# EAGLE schematic pdp8i (EAGLE 6.6.0), part 1 of 4

## Sheet 1 of 40
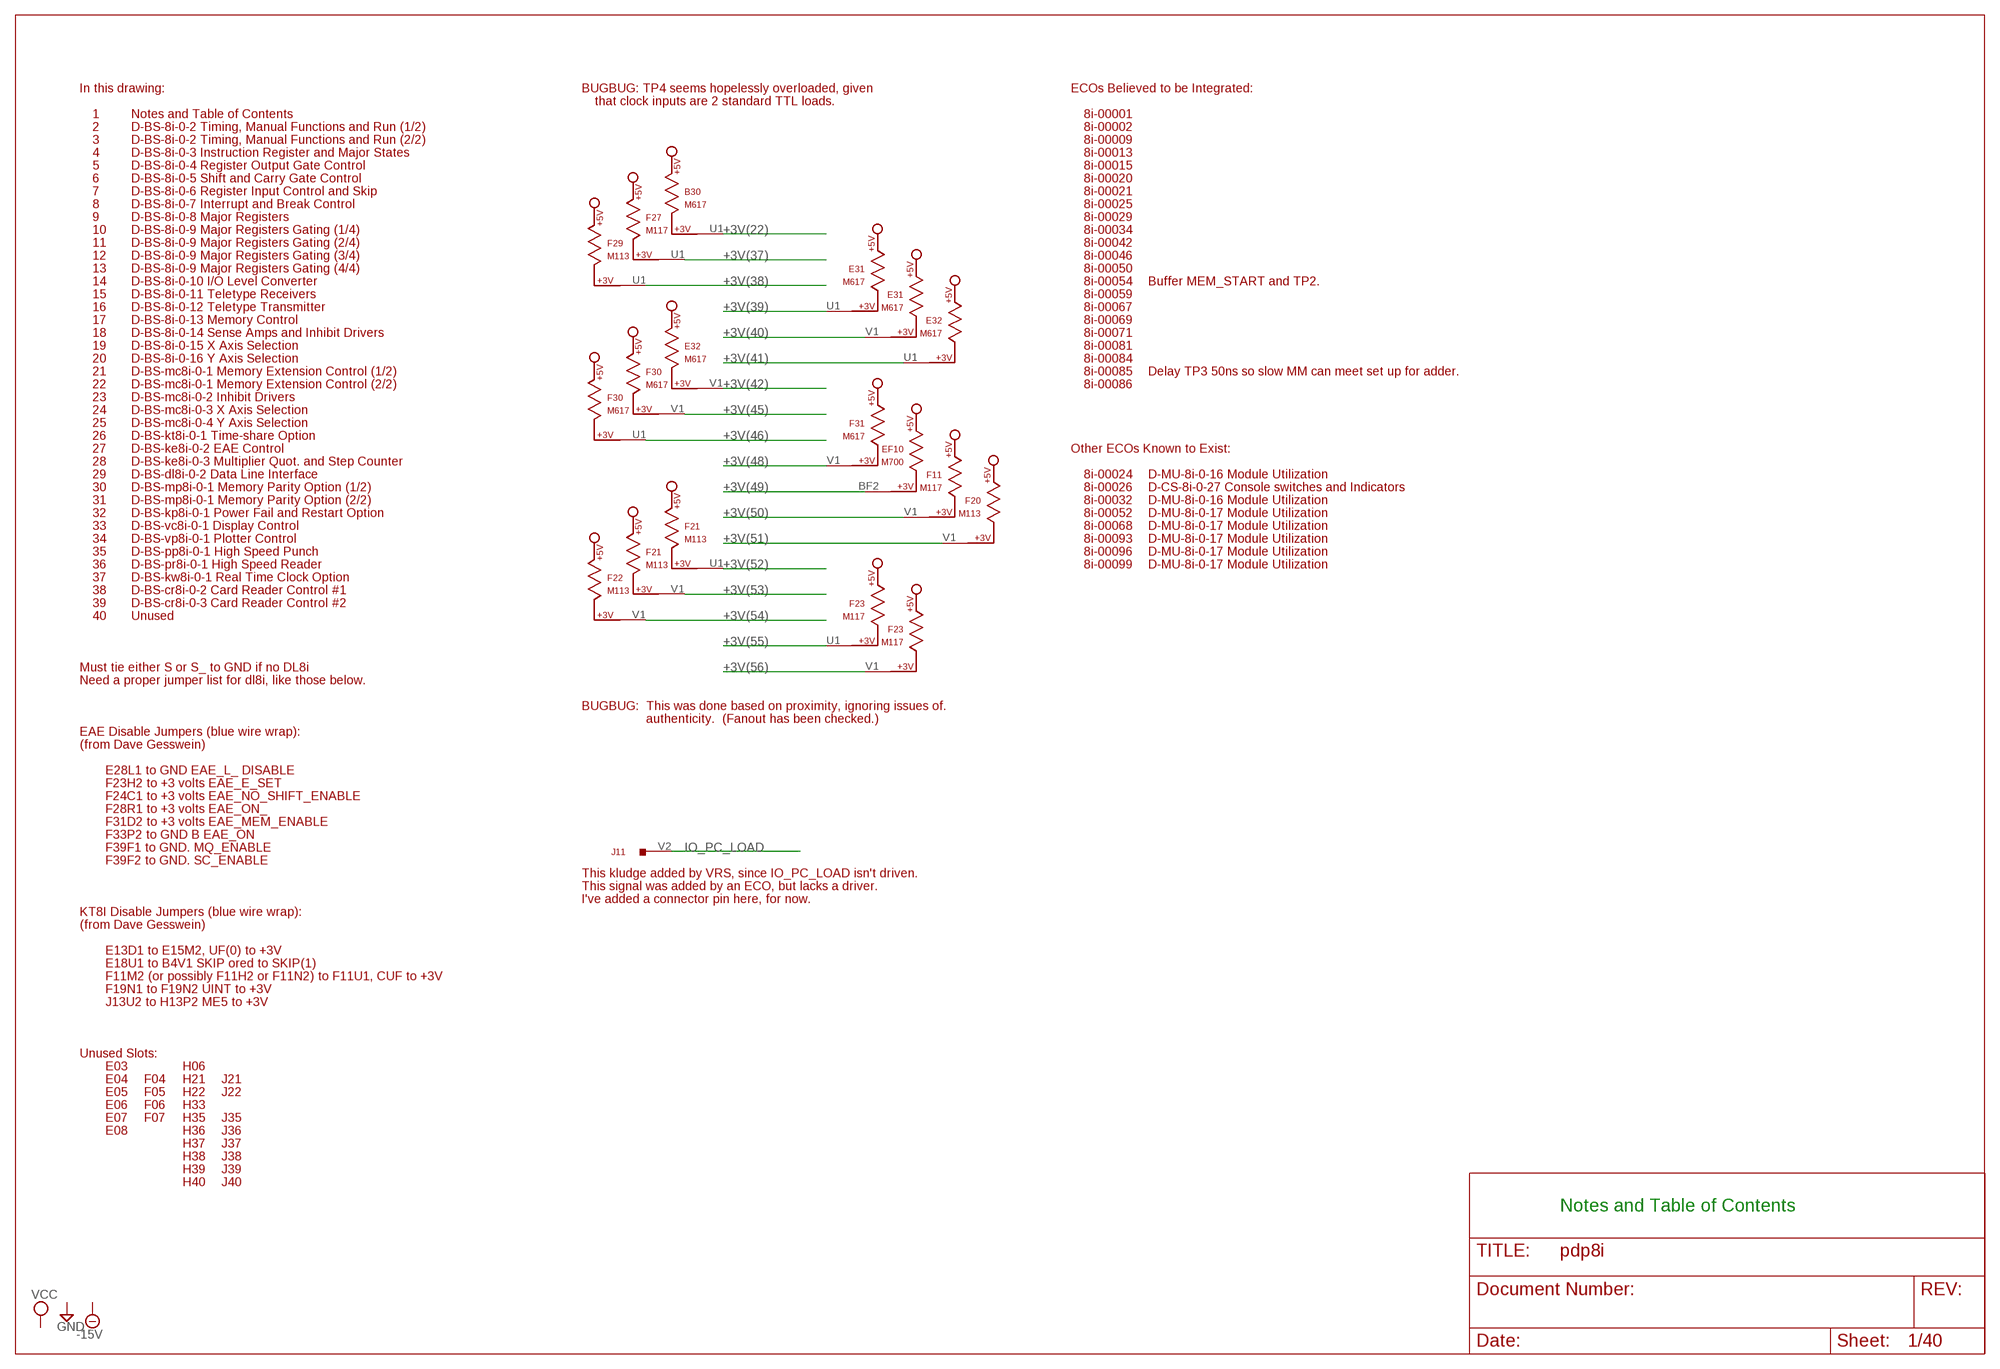
[diagram p0: schematic, sheet 1]

### Parts
B30  M617  [H807]
E03  EMPTY  [H807]
E04  EMPTY  [H807]
E05  EMPTY  [H807]
E06  EMPTY  [H807]
E07  EMPTY  [H807]
E08  EMPTY  [H807]
E31  M617  [H807]
E32  M617  [H807]
EF10  M700  [H807-2]
F04  EMPTY  [H807]
F05  EMPTY  [H807]
F06  EMPTY  [H807]
F07  EMPTY  [H807]
F11  M117  [H807]
F20  M113  [H807]
F21  M113  [H807]
F22  M113  [H807]
F23  M117  [H807]
F27  M117  [H807]
F29  M113  [H807]
F30  M617  [H807]
F31  M617  [H807]
H06  EMPTY  [H807]
H21  EMPTY  [H807]
H22  EMPTY  [H807]
H33  EMPTY  [H807]
H35  EMPTY  [H807]
H36  EMPTY  [H807]
H37  EMPTY  [H807]
H38  EMPTY  [H807]
H39  EMPTY  [H807]
H40  EMPTY  [H807]
J11  W011  [H807]
J21  EMPTY  [H807]
J22  EMPTY  [H807]
J35  EMPTY  [H807]
J36  EMPTY  [H807]
J37  EMPTY  [H807]
J38  EMPTY  [H807]
J39  EMPTY  [H807]
J40  EMPTY  [H807]

### Nets
+3V(22): B30.U1 ; also sheet 17
+3V(37): F27.U1 ; also sheet 5,6,7
+3V(38): F29.U1 ; also sheet 5
+3V(39): E31.U1 ; also sheet 5,6
+3V(40): E31.V1 ; also sheet 6
+3V(41): E32.U1 ; also sheet 7
+3V(42): E32.V1 ; also sheet 5,8,9,17
+3V(45): F30.V1 ; also sheet 5,7
+3V(46): F30.U1 ; also sheet 2,5,37
+3V(48): F31.V1 ; also sheet 6,7,9
+3V(49): EF10.BF2 ; also sheet 14
+3V(50): F11.V1 ; also sheet 14
+3V(51): F20.V1 ; also sheet 14
+3V(52): F21.U1 ; also sheet 14
+3V(53): F21.V1 ; also sheet 14
+3V(54): F22.V1 ; also sheet 14
+3V(55): F23.U1 ; also sheet 4,14
+3V(56): F23.V1 ; also sheet 14
IO_PC_LOAD: J11.V2 ; also sheet 7
Unconnected: B30.V1 F27.V1 F29.V1 J11.K2 J11.M2 J11.P2 J11.S2 J11.T2

### Notes on the sheet
- In this drawing: | BUGBUG: TP4 seems hopelessly overloaded, given | ECOs Believed to be Integrated:
- that clock inputs are 2 standard TTL loads.
- 1 | Notes and Table of Contents | 8i-00001
- 2 | D-BS-8i-0-2 Timing, Manual Functions and Run (1/2) | 8i-00002
- 3 | D-BS-8i-0-2 Timing, Manual Functions and Run (2/2) | 8i-00009
- 4 | D-BS-8i-0-3 Instruction Register and Major States | 8i-00013
- 5 | D-BS-8i-0-4 Register Output Gate Control | 8i-00015
- 6 | D-BS-8i-0-5 Shift and Carry Gate Control | 8i-00020
- 7 | D-BS-8i-0-6 Register Input Control and Skip | 8i-00021
- 8 | D-BS-8i-0-7 Interrupt and Break Control | 8i-00025
- 9 | D-BS-8i-0-8 Major Registers | 8i-00029
- 10 | D-BS-8i-0-9 Major Registers Gating (1/4) | 8i-00034
- 11 | D-BS-8i-0-9 Major Registers Gating (2/4) | 8i-00042
- 12 | D-BS-8i-0-9 Major Registers Gating (3/4) | 8i-00046
- 13 | D-BS-8i-0-9 Major Registers Gating (4/4) | 8i-00050
- 14 | D-BS-8i-0-10 I/O Level Converter | 8i-00054 | Buffer MEM_START and TP2.
- 15 | D-BS-8i-0-11 Teletype Receivers | 8i-00059
- 16 | D-BS-8i-0-12 Teletype Transmitter | 8i-00067
- 17 | D-BS-8i-0-13 Memory Control | 8i-00069
- 18 | D-BS-8i-0-14 Sense Amps and Inhibit Drivers | 8i-00071
- 19 | D-BS-8i-0-15 X Axis Selection | 8i-00081
- 20 | D-BS-8i-0-16 Y Axis Selection | 8i-00084
- 21 | D-BS-mc8i-0-1 Memory Extension Control (1/2) | 8i-00085 | Delay TP3 50ns so slow MM can meet set up for adder.
- 22 | D-BS-mc8i-0-1 Memory Extension Control (2/2) | 8i-00086
- 23 | D-BS-mc8i-0-2 Inhibit Drivers
- 24 | D-BS-mc8i-0-3 X Axis Selection
- 25 | D-BS-mc8i-0-4 Y Axis Selection
- 26 | D-BS-kt8i-0-1 Time-share Option
- 27 | D-BS-ke8i-0-2 EAE Control | Other ECOs Known to Exist:
- 28 | D-BS-ke8i-0-3 Multiplier Quot. and Step Counter
- 29 | D-BS-dl8i-0-2 Data Line Interface | 8i-00024 | D-MU-8i-0-16 Module Utilization
- 30 | D-BS-mp8i-0-1 Memory Parity Option (1/2) | 8i-00026 | D-CS-8i-0-27 Console switches and Indicators
- 31 | D-BS-mp8i-0-1 Memory Parity Option (2/2) | 8i-00032 | D-MU-8i-0-16 Module Utilization
- 32 | D-BS-kp8i-0-1 Power Fail and Restart Option | 8i-00052 | D-MU-8i-0-17 Module Utilization
- 33 | D-BS-vc8i-0-1 Display Control | 8i-00068 | D-MU-8i-0-17 Module Utilization
- 34 | D-BS-vp8i-0-1 Plotter Control | 8i-00093 | D-MU-8i-0-17 Module Utilization
- 35 | D-BS-pp8i-0-1 High Speed Punch | 8i-00096 | D-MU-8i-0-17 Module Utilization
- 36 | D-BS-pr8i-0-1 High Speed Reader | 8i-00099 | D-MU-8i-0-17 Module Utilization
- 37 | D-BS-kw8i-0-1 Real Time Clock Option
- 38 | D-BS-cr8i-0-2 Card Reader Control #1
- 39 | D-BS-cr8i-0-3 Card Reader Control #2
- 40 | Unused
- Must tie either S or S_ to GND if no DL8i
- Need a proper jumper list for dl8i, like those below.
- BUGBUG:  This was done based on proximity, ignoring issues of.
- authenticity.  (Fanout has been checked.)
- EAE Disable Jumpers (blue wire wrap):
- (from Dave Gesswein)
- E28L1 to GND EAE_L_ DISABLE
- F23H2 to +3 volts EAE_E_SET
- F24C1 to +3 volts EAE_NO_SHIFT_ENABLE
- F28R1 to +3 volts EAE_ON_
- F31D2 to +3 volts EAE_MEM_ENABLE
- F33P2 to GND B EAE_ON
- F39F1 to GND. MQ_ENABLE
- F39F2 to GND. SC_ENABLE
- This kludge added by VRS, since IO_PC_LOAD isn't driven.
- This signal was added by an ECO, but lacks a driver.
- I've added a connector pin here, for now.
- KT8I Disable Jumpers (blue wire wrap):
- (from Dave Gesswein)
- E13D1 to E15M2, UF(0) to +3V
- E18U1 to B4V1 SKIP ored to SKIP(1)
- F11M2 (or possibly F11H2 or F11N2) to F11U1, CUF to +3V
- F19N1 to F19N2 UINT to +3V
- J13U2 to H13P2 ME5 to +3V
- Unused Slots:
- Notes and Table of Contents

## Sheet 2 of 40
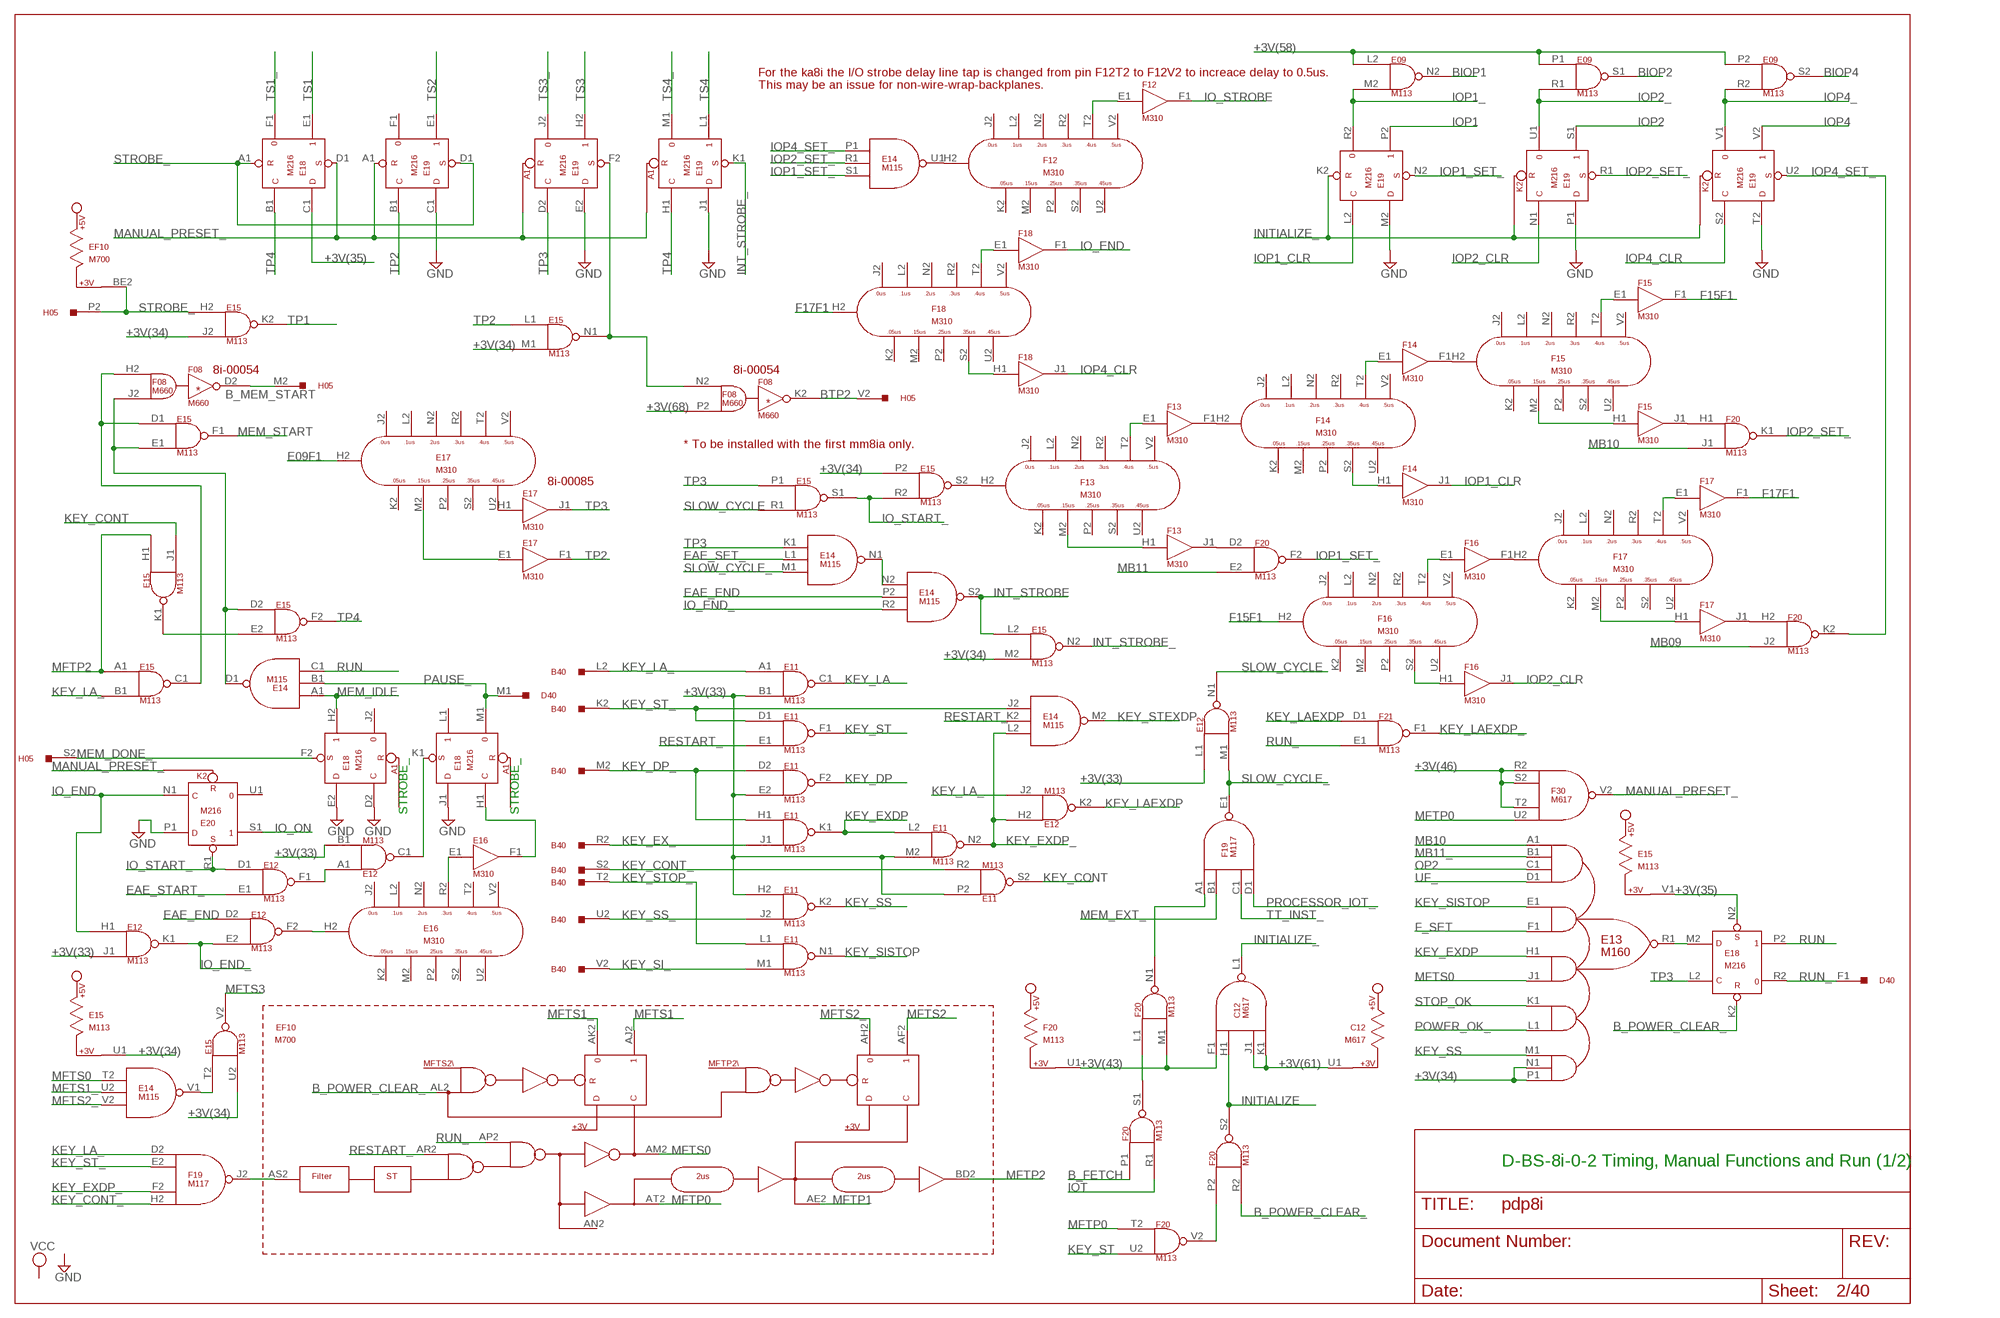
[diagram p1: schematic, sheet 2]

### Parts
B40  W077  M916  [H807]
C12  M617  [H807]
D40  M900  M916  [H807]
E09  M113  [H807]
E11  M113  [H807]
E12  M113  [H807]
E13  M160  [H807]
E14  M115  [H807]
E15  M113  [H807]
E16  M310  [H807]
E17  M310  [H807]
E18  M216  M206X  [H807]
E19  M216  M206X  [H807]
E20  M216  M206X  [H807]
F08  M660  [H807]
F12  M310  [H807]
F13  M310  [H807]
F14  M310  [H807]
F15  M310  [H807]
F16  M310  [H807]
F17  M310  [H807]
F18  M310  [H807]
F19  M117  [H807]
H05  W011  [H807]

### Nets
+3V(33): E11.B1(C1:IN2) E11.E2(F2:IN2) E11.H2(K2:IN1) E11.M2(N2:IN2) E11.P2(S2:IN1) E12.B1(C1:IN2) E12.J1(K1:IN2) E12.L1(N1:IN1) ; also sheet 15,16
+3V(34): E13.N1(R1:IN5B) E13.P1(R1:IN5C) E15.J2(K2:IN2) E15.M1(N1:IN2) E15.M2(N2:IN2) E15.P2(S2:IN1) E15.U1 E15.U2(V2:IN2)
+3V(35): E15.V1 E18.C1(E1:D) E18.N2(P2:S) ; also sheet 4
+3V(43): C12.F1(L1:IN1) F20.M1(N1:IN2) F20.U1 ; also sheet 5,8,16
+3V(46): F30.R2(V2:IN1) F30.S2(V2:IN2) F30.T2(V2:IN3) ; also sheet 1,5,37
+3V(58): E09.L2(N2:IN1) E09.P1(S1:IN1) E09.P2(S2:IN1) ; also sheet 3,17,29
+3V(61): C12.J1(L1:IN3) C12.K1(L1:IN4) C12.U1 ; also sheet 8,17
+3V(68): F08.P2(K:IN2) ; also sheet 22
B_FETCH: F20.P1(S1:IN1) ; also sheet 4,5,6,7,8,22,27,29
B_MEM_START: F08.D2(D:OUT) H05.M2
B_POWER_CLEAR_: E18.K2(P2:R) EF10.AL2(CL2) F20.R2(S2:IN2) ; also sheet 17,27
BIOP1: E09.N2(N2:OUT) ; also sheet 38
BIOP2: E09.S1(S1:OUT) ; also sheet 38
BIOP4: E09.S2(S2:OUT) ; also sheet 38
BTP2: F08.K2(K:OUT) H05.V2
E09F1: E17.H2(H2:H2) ; also sheet 3
EAE_END: E12.D2(F2:IN1) E14.P2(S2:IN2) ; also sheet 27
EAE_SET_: E14.L1(N1:IN2) ; also sheet 27
EAE_START_: E12.E1(F1:IN2) ; also sheet 27
F15F1: F15.F1(F1:OUT) F16.H2(H2:H2)
F17F1: F17.F1(F1:OUT) F18.H2(H2:H2)
F_SET: E13.F1(R1:IN2B) ; also sheet 4,8
GND [Suppply]: E18.D2(H2:C) E18.E2(H2:D) E18.J1(L1:D) E19.C1(E1:D) E19.E2(H2:D) E19.J1(L1:D) E19.M2(P2:D) E19.P1(S1:D) E19.T2(V2:D) E20.P1(S1:D) ; also sheet 5,9,10,11,12,13,14,15,17,18,23,26,27,30,33,34,35,39
INITIALIZE: C12.H1(L1:IN2) F20.S2(S2:OUT) ; also sheet 15,16,33,34,36
INITIALIZE_: C12.L1(L1:OUT) E19.K2(P2:R) ; also sheet 14,26,30,32,35,36,37,38,39
INT_STROBE: E14.S2(S2:OUT) E15.L2(N2:IN1) ; also sheet 8
INT_STROBE_: E15.N2(N2:OUT) E19.K1(L1:S) ; also sheet 8
IO_END: E12.H1(K1:IN1) E20.N1(S1:C) F18.F1(F1:OUT)
IO_END_: E12.E2(F2:IN2) E12.K1(K1:OUT) E14.R2(S2:IN3)
IO_ON: E20.S1 ; also sheet 5
IO_START_: E12.D1(F1:IN1) E15.R2(S2:IN2) E15.S1(S1:OUT) E20.R1(S1:S)
IO_STROBE: F12.F1(F1:OUT) ; also sheet 7
IOP1: E19.P2 ; also sheet 15,16,30,33,34,35,36
IOP1_: E09.M2(N2:IN2) E19.R2 ; also sheet 5,14,34,37
IOP1_CLR: E19.L2(P2:C) F14.J1(J1:OUT)
IOP1_SET_: E14.S1(U1:IN3) E19.N2(P2:S) F20.F2(F2:OUT)
IOP2: E19.S1 ; also sheet 15,16,32,33,34,35,36
IOP2_: E09.R1(S1:IN2) E19.U1 ; also sheet 5,14,34,37
IOP2_CLR: E19.N1(S1:C) F16.J1(J1:OUT)
IOP2_SET_: E14.R1(U1:IN2) E19.R1(S1:S) F20.K1(K1:OUT)
IOP4: E19.V2 ; also sheet 15,16,30,33,34,35,36
IOP4_: E09.R2(S2:IN2) E19.V1 ; also sheet 5,14,37
IOP4_CLR: E19.S2(V2:C) F18.J1(J1:OUT)
IOP4_SET_: E14.P1(U1:IN1) E19.U2(V2:S) F20.K2(K2:OUT)
IOT: F20.R1(S1:IN2) ; also sheet 4,7,8,22,29
KEY_CONT: E11.S2(S2:OUT) E15.J1(K1:IN2)
KEY_CONT_: B40.S2 E11.R2(S2:IN2) F19.H2(J2:IN4)
KEY_DP: E11.F2(F2:OUT) ; also sheet 5
KEY_DP_: B40.M2 E11.D2(F2:IN1) E11.H1(K1:IN1)
KEY_EX_: B40.R2 E11.J1(K1:IN2)
KEY_EXDP: E11.K1(K1:OUT) E11.L2(N2:IN1) E13.H1(R1:IN3A) ; also sheet 5,6
KEY_EXDP_: E11.N2(N2:OUT) E12.H2(K2:IN1) E14.L2(M2:IN3) F19.F2(J2:IN3)
KEY_LA: E11.C1(C1:OUT) ; also sheet 5
KEY_LA_: B40.L2 E11.A1(C1:IN1) E12.J2(K2:IN2) E15.B1(C1:IN2) F19.D2(J2:IN1)
KEY_LAEXDP: E12.K2(K2:OUT) F21.D1(F1:IN1) ; also sheet 7
KEY_LAEXDP_: F21.F1(F1:OUT) ; also sheet 8
KEY_SI_: B40.V2 E11.M1(N1:IN2)
KEY_SISTOP: E11.N1(N1:OUT) E13.E1(R1:IN2A)
KEY_SS: E11.K2(K2:OUT) E13.M1(R1:IN5A)
KEY_SS_: B40.U2 E11.J2(K2:IN2)
KEY_ST: E11.F1(F1:OUT) F20.U2(V2:IN2) ; also sheet 4,5,7,8
KEY_ST_: B40.K2 E11.D1(F1:IN1) E14.J2(M2:IN1) F19.E2(J2:IN2)
KEY_STEXDP: E14.M2(M2:OUT) ; also sheet 5,7,21
KEY_STOP_: B40.T2 E11.L1(N1:IN1)
MANUAL_PRESET_: E18.D1(E1:S) E19.A1(E1:R) F30.V2(V2:OUT) ; also sheet 4,8,21,29
MB09: F20.J2(K2:IN2) ; also sheet 5,6,9,14,21,22,27,29,30,37
MB10: E13.A1(R1:IN1A) F20.J1(K1:IN2) ; also sheet 6,8,9,14,21,22,27,29,30,33,37
MB11: F20.E2(F2:IN2) ; also sheet 6,9,14,21,22,27,29,30,33,37
MB11_: E13.B1(R1:IN1B) ; also sheet 5,7,8,9,18,22,23,26,28,29,30
MEM_DONE_: E18.F2(H2:S) H05.S2 ; also sheet 8,17,21,29
MEM_EXT_: F19.B1(E1:IN2) ; also sheet 22
MEM_IDLE: E14.A1(D1:IN1) E18.H2
MEM_START: E15.F1(F1:OUT) ; also sheet 17
MFTP0: EF10.AT2(CT2) F20.T2(V2:IN1) F30.U2(V2:IN4)
MFTP1: EF10.AE2(CE2) ; also sheet 7,21
MFTP2: E15.A1(C1:IN1) E15.H1(K1:IN1) EF10.BD2(DD2) ; also sheet 4,7,8
MFTS0: E13.J1(R1:IN3B) E14.T2(V1:IN1) EF10.AM2(CM2) ; also sheet 5
MFTS1: EF10.AJ2(CJ2) ; also sheet 5
MFTS1_: E14.U2(V1:IN2) EF10.AK2(CK2)
MFTS2: EF10.AF2(CF2) ; also sheet 5,6
MFTS2_: E14.V2(V1:IN3) EF10.AH2(CH2) ; also sheet 27
MFTS3: E15.V2(V2:OUT) ; also sheet 5
N$7: EF10.AS2(CS2) F19.J2(J2:OUT)
N$8: F20.P2(S2:IN1) F20.V2(V2:OUT)
N$9: F20.L1(N1:IN1) F20.S1(S1:OUT)
N$11: E13.R1(R1:OUT) E18.M2(P2:D)
N$12: F19.A1(E1:IN1) F20.N1(N1:OUT)
N$13: E14.V1(V1:OUT) E15.T2(V2:IN1)
N$14: E16.E1(F1:IN) E16.R2(H2:R2)
N$15: E12.A1(C1:IN1) E12.F1(F1:OUT)
N$16: E12.C1(C1:OUT) E18.K1(L1:S)
N$17: E12.F2(F2:OUT) E16.H2(H2:H2)
N$18: E16.F1(F1:OUT) E18.H1(L1:C)
N$19: E14.D1(D1:OUT) E15.D2(F2:IN1) E15.E1(F1:IN2) F08.J2(D:IN2)
N$20: E15.C1(C1:OUT) E15.D1(F1:IN1) F08.H2(D:IN1)
N$21: E15.E2(F2:IN2) E15.K1(K1:OUT)
N$22: E17.E1(F1:IN) E17.M2(H2:M2)
N$24: E15.N1(N1:OUT) E19.F2(H2:S) F08.N2(K:IN1)
N$25: E14.N1(N1:OUT) E14.N2(S2:IN1)
N$29: E15.S2(S2:OUT) F13.H2(H2:H2)
N$30: F13.H1(J1:IN) F13.M2(H2:M2)
N$31: F13.E1(F1:IN) F13.T2(H2:T2)
N$32: F13.F1(F1:OUT) F14.H2(H2:H2)
N$33: F14.H1(J1:IN) F14.S2(H2:S2)
N$34: F14.E1(F1:IN) F14.T2(H2:T2)
N$35: F14.F1(F1:OUT) F15.H2(H2:H2)
N$36: F13.J1(J1:OUT) F20.D2(F2:IN1)
N$37: F15.H1(J1:IN) F15.M2(H2:M2)
N$38: F15.E1(F1:IN) F15.T2(H2:T2)
N$39: F15.J1(J1:OUT) F20.H1(K1:IN1)
N$40: F16.H1(J1:IN) F16.S2(H2:S2)
N$41: F16.E1(F1:IN) F16.T2(H2:T2)
N$42: F16.F1(F1:OUT) F17.H2(H2:H2)
N$43: F17.H1(J1:IN) F17.M2(H2:M2)
N$44: F17.E1(F1:IN) F17.T2(H2:T2)
N$45: F17.J1(J1:OUT) F20.H2(K2:IN1)
N$46: E14.U1(U1:OUT) F12.H2(H2:H2)
N$47: F12.E1(F1:IN) F12.T2(H2:T2)
N$48: F18.H1(J1:IN) F18.S2(H2:S2)
N$49: F18.E1(F1:IN) F18.T2(H2:T2)
N$748: E17.H1(J1:IN) E17.U2(H2:U2)
OP2: E13.C1(R1:IN1C) ; also sheet 5,7,26,27
PAUSE_: D40.M1 E14.B1(D1:IN2) E18.M1
POWER_OK_: E13.L1(R1:IN4B) ; also sheet 17
PROCESSOR_IOT_: F19.D1(E1:IN4) ; also sheet 8
RESTART_: E11.E1(F1:IN2) E14.K2(M2:IN2) EF10.AR2(CR2) ; also sheet 5,32
RUN: E14.C1(D1:IN3) E18.P2 ; also sheet 21
RUN_: D40.F1 E18.R2 EF10.AP2(CP2) F21.E1(F1:IN2) ; also sheet 14
SLOW_CYCLE: E12.N1(N1:OUT) E15.R1(S1:IN2)
SLOW_CYCLE_: E12.M1(N1:IN2) E14.M1(N1:IN3) F19.E1(E1:OUT)
STOP_OK: E13.K1(R1:IN4A) ; also sheet 17,32
STROBE_: E15.H2(K2:IN1) E18.A1(E1:R) E19.D1(E1:S) EF10.BE2 H05.P2 ; also sheet 8,17,21
TP1: E15.K2(K2:OUT) ; also sheet 3,4,7,8
TP2: E15.L1(N1:IN1) E17.F1(F1:OUT) E19.B1(E1:C) ; also sheet 4,7,8
TP3: E14.K1(N1:IN1) E15.P1(S1:IN1) E17.J1(J1:OUT) E18.L2(P2:C) E19.D2(H2:C) ; also sheet 7,21,22,26,27,29,30
TP4: E15.F2(F2:OUT) E18.B1(E1:C) E19.H1(L1:C) ; also sheet 4,7,8,29
TS1: E18.E1 ; also sheet 5,6,29
TS1_: E18.F1 ; also sheet 14
TS2: E19.E1 ; also sheet 5,6,7,29
TS3: E19.H2 ; also sheet 5,6,22,29
TS3_: E19.J2 ; also sheet 14
TS4: E19.L1 ; also sheet 5,8
TS4_: E19.M1 ; also sheet 21
TT_INST_: F19.C1(E1:IN3) ; also sheet 9,14,29
UF_: E13.D1(R1:IN1D) ; also sheet 4,5,26
Unconnected: B40.A1 B40.B1 B40.B2 B40.C1 B40.D1 B40.E1 B40.F1 B40.H1 B40.J1 B40.K1 B40.L1 B40.M1 B40.N1 B40.N2 B40.P1 B40.P2 B40.R1 B40.S1 B40.T1 B40.U1 B40.V1 C12.R2(V2:IN1) C12.S2(V2:IN2) C12.T2(V2:IN3) C12.U2(V2:IN4) C12.V2(V2:OUT) D40.A2 D40.B2 D40.C1 D40.C2 D40.F2 D40.H1 D40.J1 D40.J2 D40.K1 D40.K2 D40.L1 D40.N2 D40.P2 D40.S2 D40.T1 D40.U1 D40.U2 D40.V1 D40.V2 E09.L1(N1:IN1) E09.M1(N1:IN2) E09.N1(N1:OUT) E09.U1 E09.V1 E11.U1 E11.V1 E12.U1 E12.V1 E13.D2(T2:IN1A) E13.E2(T2:IN1B) E13.F2(T2:IN1C) E13.H2(T2:IN1D) E13.J2(T2:IN2A) E13.K2(T2:IN2B) E13.L2(T2:IN3A) E13.M2(T2:IN3B) E13.N2(T2:IN4A) E13.P2(T2:IN4B) E13.R2(T2:IN4C) E13.S1(V2:IN1A) E13.S2(T2:IN4D) E13.T2(T2:OUT) E13.U1(V2:IN1B) E13.U2(V2:IN2B) E13.V1(V2:IN2A) E13.V2(V2:OUT) E16.H1(J1:IN) E16.J1(J1:OUT) E16.J2(H2:J2) E16.K2(H2:K2) E16.L2(H2:L2) E16.M2(H2:M2) E16.N2(H2:N2) E16.P2(H2:P2) E16.S2(H2:S2) E16.T2(H2:T2) E16.U2(H2:U2) E16.V2(H2:V2) E17.J2(H2:J2) E17.K2(H2:K2) E17.L2(H2:L2) E17.N2(H2:N2) E17.P2(H2:P2) E17.R2(H2:R2) E17.S2(H2:S2) E17.T2(H2:T2) E17.V2(H2:V2) E18.J2 E18.L1 E18.S2(V2:C) E18.T2(V2:D) E18.U2(V2:S) E18.V1 E18.V2 E19.F1 E20.S2(V2:C) E20.T2(V2:D) E20.U1 E20.U2(V2:S) E20.V1 E20.V2 EF10.AN2(CN2) F08.S2(S:OUT) F08.U2(S:IN1) F08.V2(S:IN2) F12.H1(J1:IN) F12.J1(J1:OUT) F12.J2(H2:J2) F12.K2(H2:K2) F12.L2(H2:L2) F12.M2(H2:M2) F12.N2(H2:N2) F12.P2(H2:P2) F12.R2(H2:R2) F12.S2(H2:S2) F12.U2(H2:U2) F12.V2(H2:V2) F13.J2(H2:J2) F13.K2(H2:K2) F13.L2(H2:L2) F13.N2(H2:N2) F13.P2(H2:P2) F13.R2(H2:R2) F13.S2(H2:S2) F13.U2(H2:U2) F13.V2(H2:V2) F14.J2(H2:J2) F14.K2(H2:K2) F14.L2(H2:L2) F14.M2(H2:M2) F14.N2(H2:N2) F14.P2(H2:P2) F14.R2(H2:R2) F14.U2(H2:U2) F14.V2(H2:V2) F15.J2(H2:J2) F15.K2(H2:K2) F15.L2(H2:L2) F15.N2(H2:N2) F15.P2(H2:P2) F15.R2(H2:R2) F15.S2(H2:S2) F15.U2(H2:U2) F15.V2(H2:V2) F16.J2(H2:J2) F16.K2(H2:K2) F16.L2(H2:L2) F16.M2(H2:M2) F16.N2(H2:N2) F16.P2(H2:P2) F16.R2(H2:R2) F16.U2(H2:U2) F16.V2(H2:V2) F17.J2(H2:J2) F17.K2(H2:K2) F17.L2(H2:L2) F17.N2(H2:N2) F17.P2(H2:P2) F17.R2(H2:R2) F17.S2(H2:S2) F17.U2(H2:U2) F17.V2(H2:V2) F18.J2(H2:J2) F18.K2(H2:K2) F18.L2(H2:L2) F18.M2(H2:M2) F18.N2(H2:N2) F18.P2(H2:P2) F18.R2(H2:R2) F18.U2(H2:U2) F18.V2(H2:V2) F19.U1 F19.V1

### Notes on the sheet
- For the ka8i the I/O strobe delay line tap is changed from pin F12T2 to F12V2 to increace delay to 0.5us.
- This may be an issue for non-wire-wrap-backplanes.
- 8i-00054 | 8i-00054
- *
- *
- * To be installed with the first mm8ia only.
- 8i-00085
- STROBE_ | STROBE_
- D-BS-8i-0-2 Timing, Manual Functions and Run (1/2)

## Sheet 3 of 40
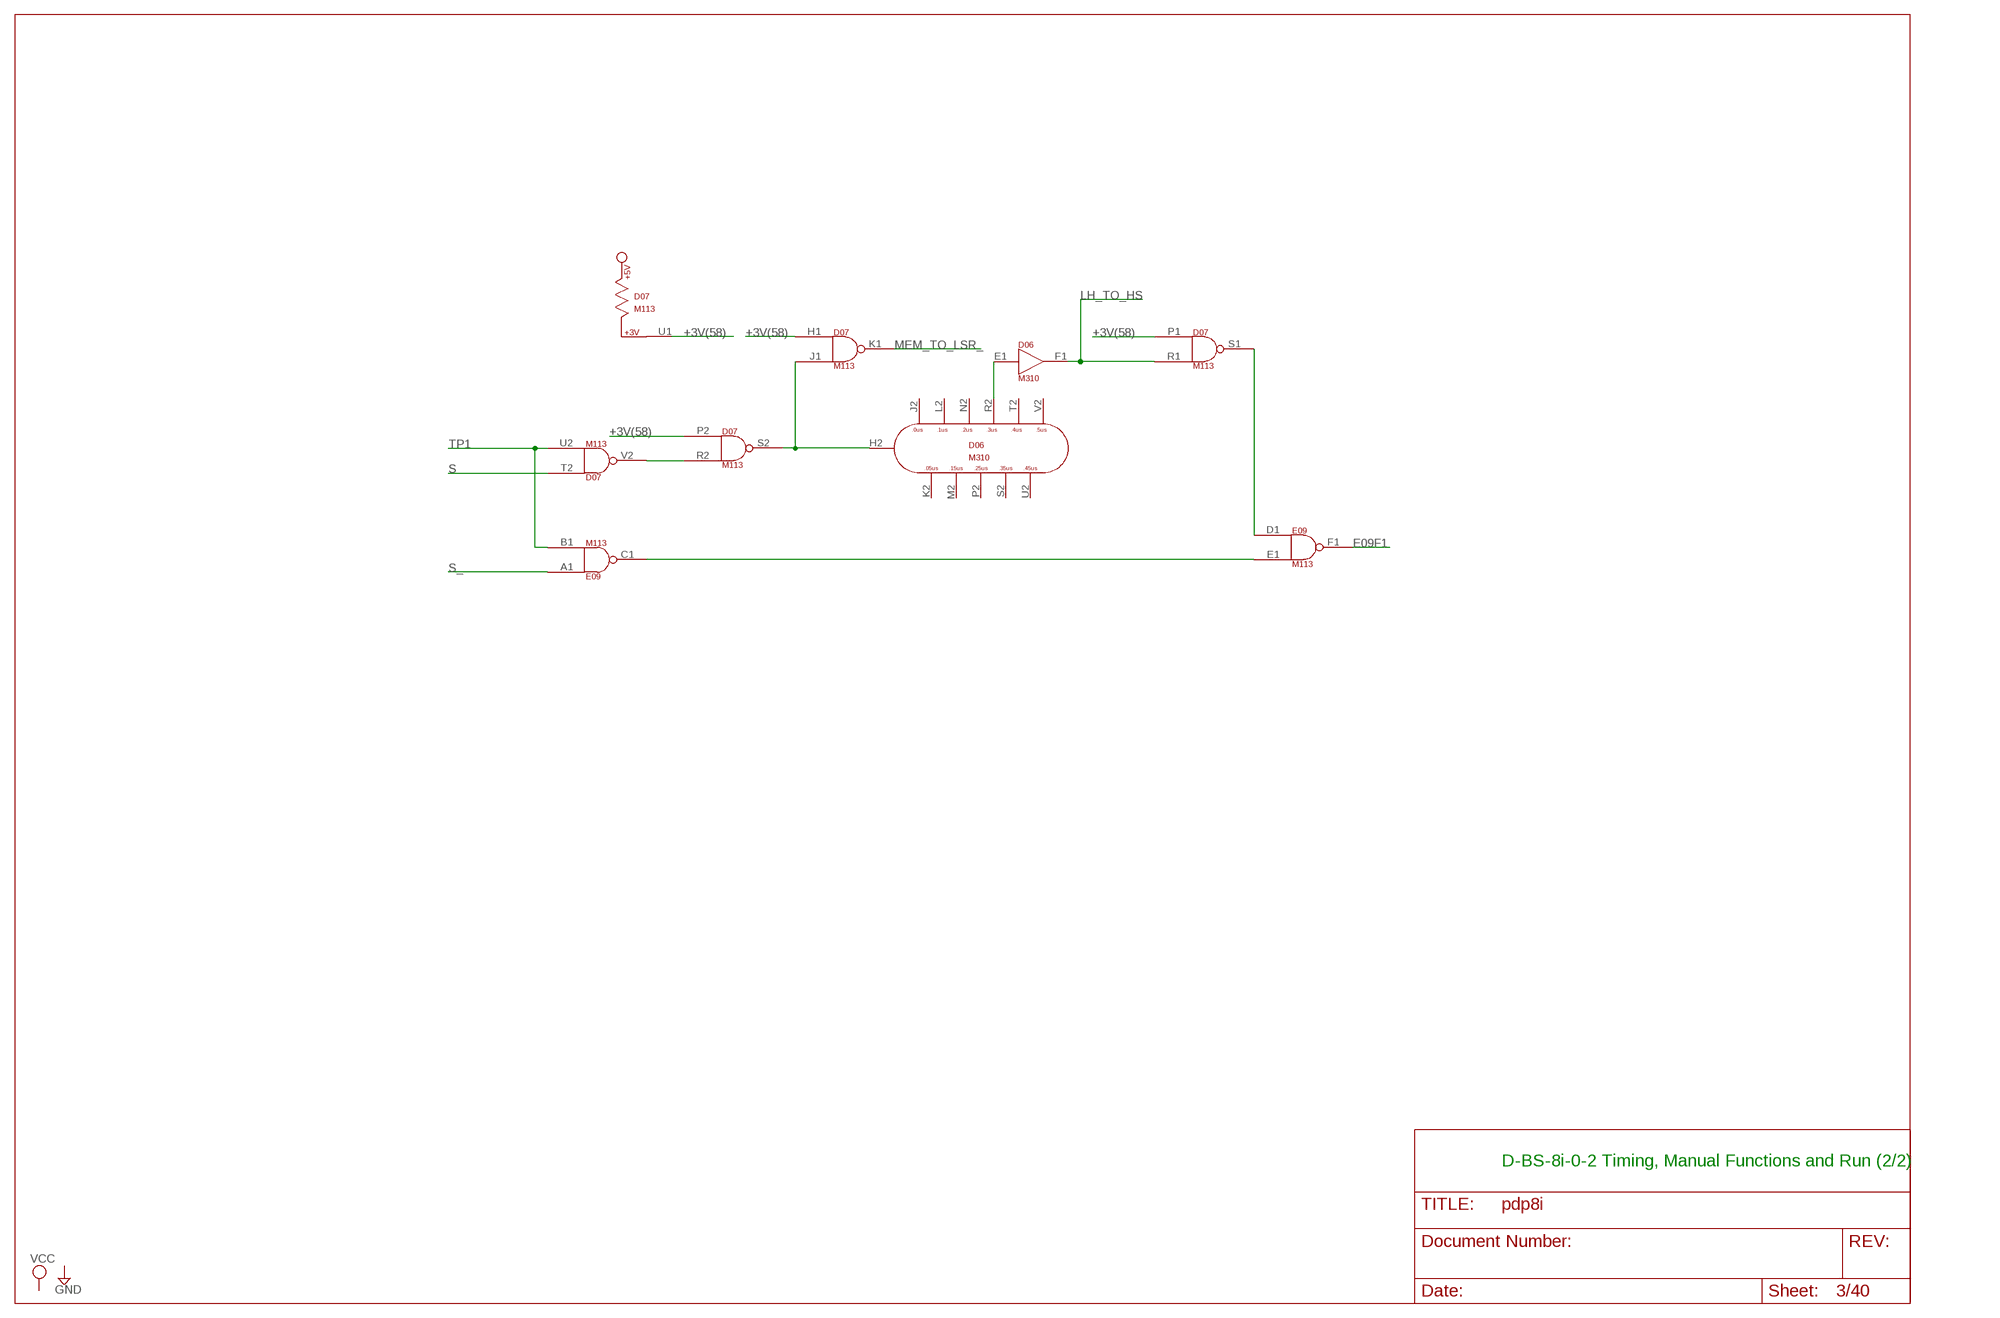
[diagram p2: schematic, sheet 3]

### Parts
D06  M310  [H807]
D07  M113  [H807]

### Nets
+3V(58): D07.H1(K1:IN1) D07.P1(S1:IN1) D07.P2(S2:IN1) D07.U1 ; also sheet 2,17,29
E09F1: E09.F1(F1:OUT) ; also sheet 2
LH_TO_HS: D06.F1(F1:OUT) D07.R1(S1:IN2) ; also sheet 29
MEM_TO_LSR_: D07.K1(K1:OUT) ; also sheet 29
N$1: E09.C1(C1:OUT) E09.E1(F1:IN2)
N$2: D07.R2(S2:IN2) D07.V2(V2:OUT)
N$3: D06.H2(H2:H2) D07.J1(K1:IN2) D07.S2(S2:OUT)
N$4: D06.E1(F1:IN) D06.R2(H2:R2)
N$5: D07.S1(S1:OUT) E09.D1(F1:IN1)
S: D07.T2(V2:IN1) ; also sheet 17,29
S_: E09.A1(C1:IN1) ; also sheet 17,29
TP1: D07.U2(V2:IN2) E09.B1(C1:IN2) ; also sheet 2,4,7,8
Unconnected: D06.H1(J1:IN) D06.J1(J1:OUT) D06.J2(H2:J2) D06.K2(H2:K2) D06.L2(H2:L2) D06.M2(H2:M2) D06.N2(H2:N2) D06.P2(H2:P2) D06.S2(H2:S2) D06.T2(H2:T2) D06.U2(H2:U2) D06.V2(H2:V2) D07.V1

### Notes on the sheet
- D-BS-8i-0-2 Timing, Manual Functions and Run (2/2)

## Sheet 4 of 40
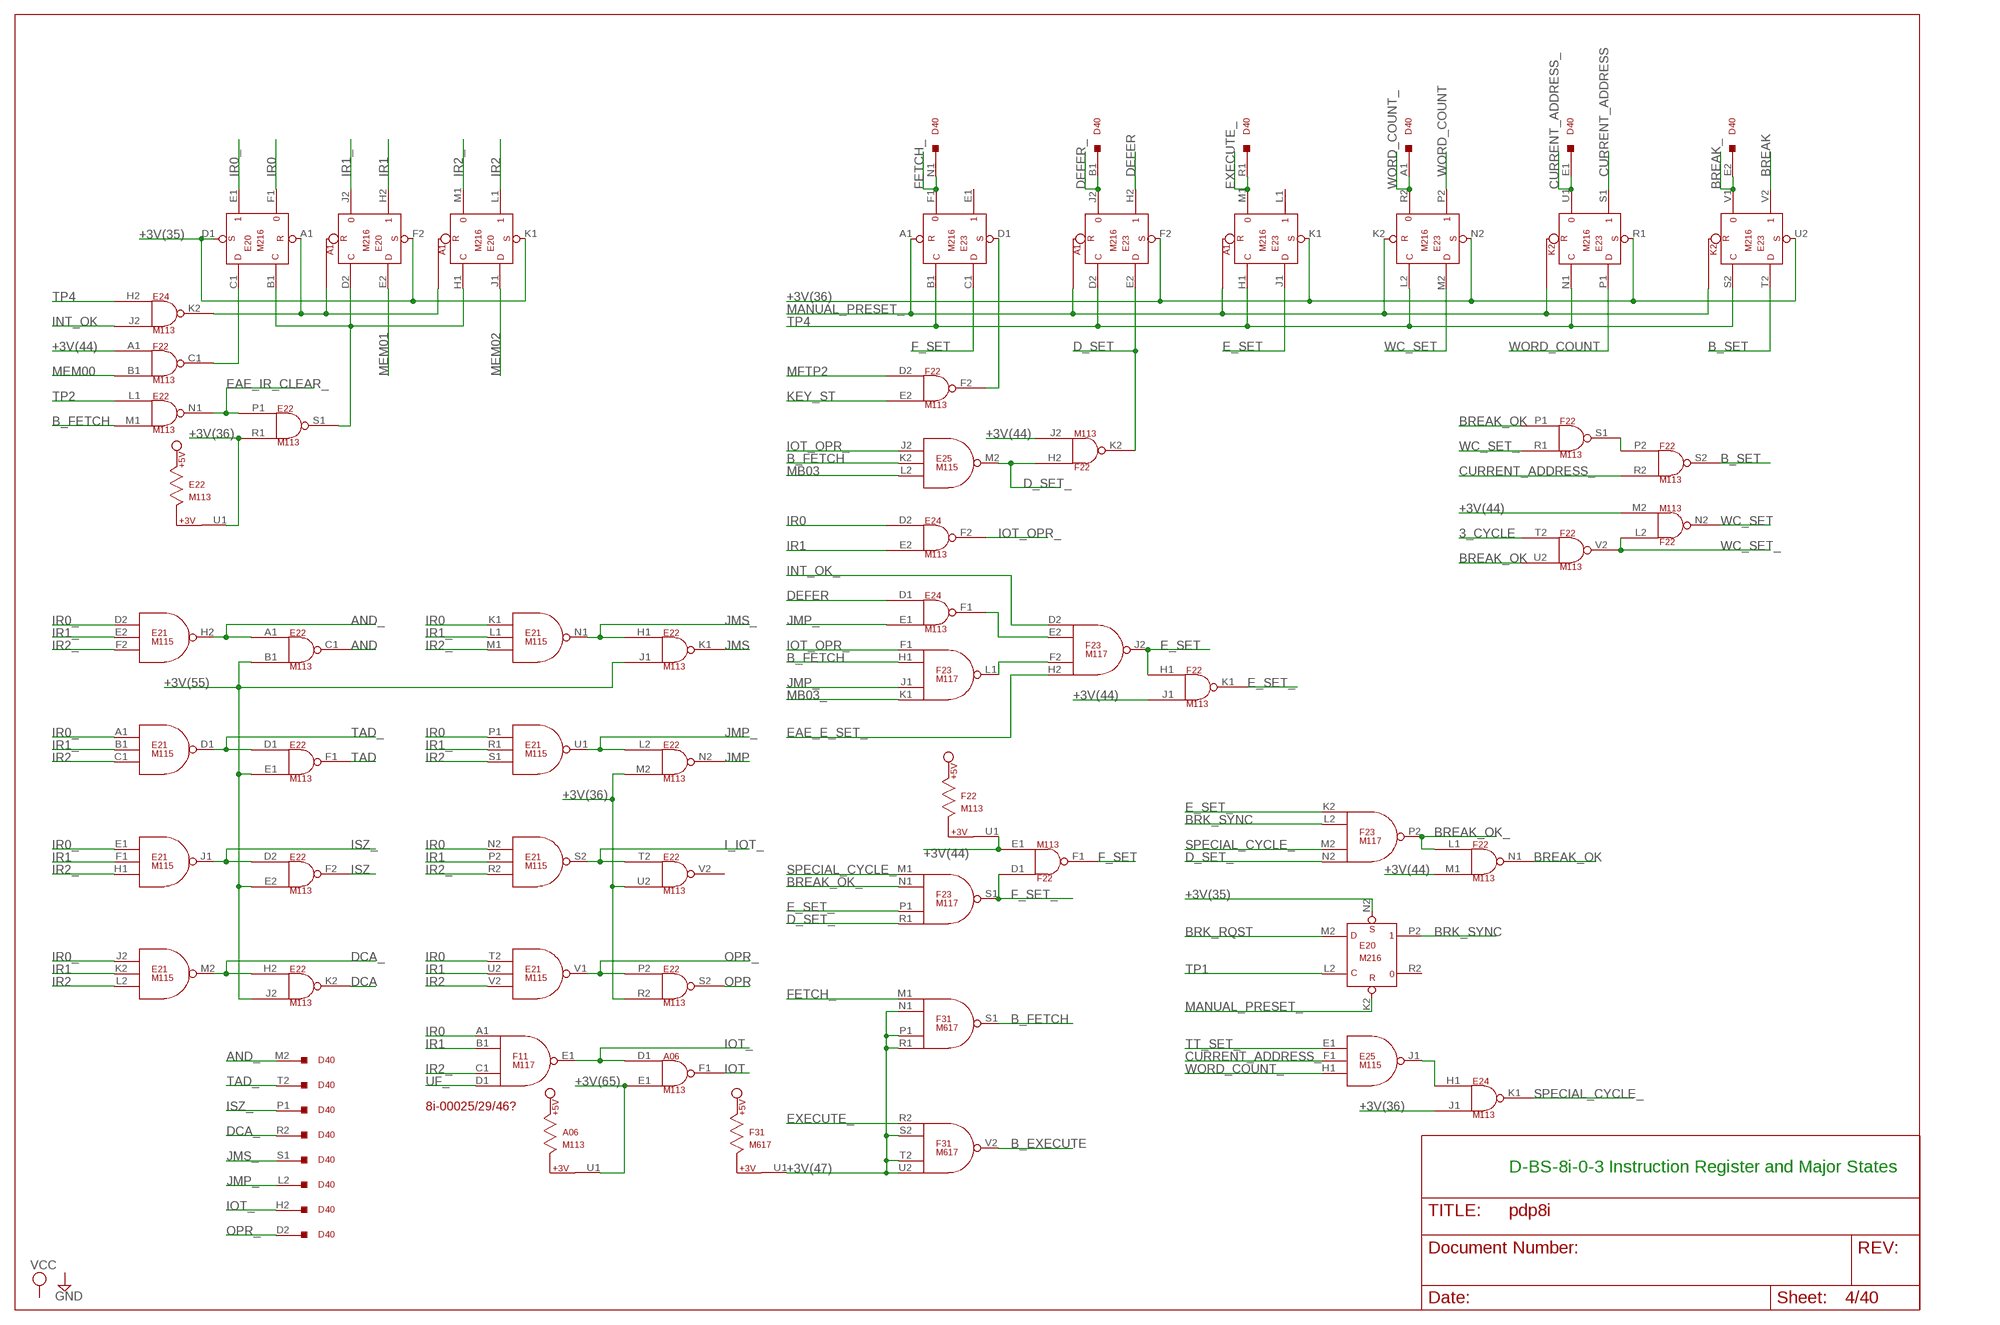
[diagram p3: schematic, sheet 4]

### Parts
A06  M113  [H807]
E21  M115  [H807]
E22  M113  [H807]
E23  M216  M206X  [H807]
E24  M113  [H807]
E25  M115  [H807]

### Nets
3_CYCLE: F22.T2(V2:IN1) ; also sheet 14
+3V(35): E20.D1(E1:S) E20.F2(H2:S) E20.K1(L1:S) E20.N2(P2:S) ; also sheet 2
+3V(36): E22.M2(N2:IN2) E22.R1(S1:IN2) E22.R2(S2:IN2) E22.U1 E22.U2(V2:IN2) E23.F2(H2:S) E23.K1(L1:S) E23.N2(P2:S) E23.R1(S1:S) E23.U2(V2:S) E24.J1(K1:IN2) ; also sheet 7
+3V(44): F22.A1(C1:IN1) F22.E1(F1:IN2) F22.J1(K1:IN2) F22.J2(K2:IN2) F22.M1(N1:IN2) F22.M2(N2:IN2) F22.U1 ; also sheet 6,7
+3V(47): F31.N1(S1:IN2) F31.P1(S1:IN3) F31.R1(S1:IN4) F31.S2(V2:IN2) F31.T2(V2:IN3) F31.U1 F31.U2(V2:IN4) ; also sheet 5
+3V(55): E22.B1(C1:IN2) E22.E1(F1:IN2) E22.E2(F2:IN2) E22.J1(K1:IN2) E22.J2(K2:IN2) ; also sheet 1,14
+3V(65): A06.E1(F1:IN2) A06.U1 ; also sheet 5,26
AND: E22.C1(C1:OUT) ; also sheet 6
AND_: D40.M2 E21.H2(H2:OUT) E22.A1(C1:IN1) ; also sheet 7
B_EXECUTE: F31.V2(V2:OUT) ; also sheet 5,6,7,27
B_FETCH: E22.M1(N1:IN2) E25.K2(M2:IN2) F23.H1(L1:IN2) F31.S1(S1:OUT) ; also sheet 2,5,6,7,8,22,27,29
B_SET: E23.T2(V2:D) F22.S2(S2:OUT) ; also sheet 21
BREAK: E23.V2 ; also sheet 5,6,8
BREAK_: D40.E2 E23.V1 ; also sheet 14
BREAK_OK: F22.N1(N1:OUT) F22.P1(S1:IN1) F22.U2(V2:IN2) ; also sheet 5
BREAK_OK_: F22.L1(N1:IN1) F23.N1(S1:IN2) F23.P2(P2:OUT) ; also sheet 8
BRK_RQST: E20.M2(P2:D) ; also sheet 14
BRK_SYNC: E20.P2 F23.L2(P2:IN2)
CURRENT_ADDRESS: E23.S1 ; also sheet 5,6
CURRENT_ADDRESS_: D40.E1 E23.U1 E25.F1(J1:IN2) F22.R2(S2:IN2)
D_SET: E23.E2(H2:D) F22.K2(K2:OUT)
D_SET_: E25.M2(M2:OUT) F22.H2(K2:IN1) F23.N2(P2:IN4) F23.R1(S1:IN4) ; also sheet 5
DCA: E22.K2(K2:OUT) ; also sheet 5
DCA_: D40.R2 E21.M2(M2:OUT) E22.H2(K2:IN1) ; also sheet 7
DEFER: E23.H2 E24.D1(F1:IN1) ; also sheet 5,6,7,21
DEFER_: D40.B1 E23.J2
E_SET: E23.J1(L1:D) F22.H1(K1:IN1) F23.J2(J2:OUT)
E_SET_: F22.K1(K1:OUT) F23.K2(P2:IN1) F23.P1(S1:IN3) ; also sheet 5,22
EAE_E_SET_: F23.H2(J2:IN4) ; also sheet 5,27
EAE_IR_CLEAR_: E22.N1(N1:OUT) E22.P1(S1:IN1) ; also sheet 27
EXECUTE_: D40.R1 E23.M1 F31.R2(V2:IN1)
F_SET: E23.C1(E1:D) F22.F1(F1:OUT) ; also sheet 2,8
F_SET_: F22.D1(F1:IN1) F23.S1(S1:OUT) ; also sheet 5,22
FETCH_: D40.N1 E23.F1 F31.M1(S1:IN1) ; also sheet 6
I_IOT_: E21.S2(S2:OUT) E22.T2(V2:IN1) ; also sheet 26
INT_OK: E24.J2(K2:IN2) ; also sheet 8
INT_OK_: F23.D2(J2:IN1) ; also sheet 5,8
IOT: A06.F1(F1:OUT) ; also sheet 2,7,8,22,29
IOT_: A06.D1(F1:IN1) D40.H2 F11.E1(E1:OUT)
IOT_OPR_: E24.F2(F2:OUT) E25.J2(M2:IN1) F23.F1(L1:IN1)
IR0: E20.F1 E21.K1(N1:IN1) E21.N2(S2:IN1) E21.P1(U1:IN1) E21.T2(V1:IN1) E24.D2(F2:IN1) F11.A1(E1:IN1)
IR0_: E20.E1 E21.A1(D1:IN1) E21.D2(H2:IN1) E21.E1(J1:IN1) E21.J2(M2:IN1)
IR1: E20.H2 E21.F1(J1:IN2) E21.K2(M2:IN2) E21.P2(S2:IN2) E21.U2(V1:IN2) E24.E2(F2:IN2) F11.B1(E1:IN2)
IR1_: E20.J2 E21.B1(D1:IN2) E21.E2(H2:IN2) E21.L1(N1:IN2) E21.R1(U1:IN2)
IR2: E20.L1 E21.C1(D1:IN3) E21.L2(M2:IN3) E21.S1(U1:IN3) E21.V2(V1:IN3)
IR2_: E20.M1 E21.F2(H2:IN3) E21.H1(J1:IN3) E21.M1(N1:IN3) E21.R2(S2:IN3) F11.C1(E1:IN3)
ISZ: E22.F2(F2:OUT) ; also sheet 6,7
ISZ_: D40.P1 E21.J1(J1:OUT) E22.D2(F2:IN1)
JMP: E22.N2(N2:OUT) ; also sheet 5,7
JMP_: D40.L2 E21.U1(U1:OUT) E22.L2(N2:IN1) E24.E1(F1:IN2) F23.J1(L1:IN3) ; also sheet 5,21,22
JMS: E22.K1(K1:OUT) ; also sheet 5,6,7
JMS_: D40.S1 E21.N1(N1:OUT) E22.H1(K1:IN1) ; also sheet 21,22
KEY_ST: F22.E2(F2:IN2) ; also sheet 2,5,7,8
MANUAL_PRESET_: E20.K2(P2:R) E23.A1(E1:R) E23.K2(P2:R) ; also sheet 2,8,21,29
MB03: E25.L2(M2:IN3) ; also sheet 5,9,14,21,27,29,30,34,38
MB03_: F23.K1(L1:IN4) ; also sheet 5,6,7,8,9,14,15,16,18,22,23,30,32,33,35,36,37
MEM00: F22.B1(C1:IN2) ; also sheet 10,18,29,31
MEM01: E20.E2(H2:D) ; also sheet 10,18,31
MEM02: E20.J1(L1:D) ; also sheet 10,18,31
MFTP2: F22.D2(F2:IN1) ; also sheet 2,7,8
N$6: E20.A1(E1:R) E24.K2(K2:OUT)
N$50: E20.C1(E1:D) F22.C1(C1:OUT)
N$51: E20.B1(E1:C) E20.D2(H2:C) E20.H1(L1:C) E22.S1(S1:OUT)
N$52: E23.D1(E1:S) F22.F2(F2:OUT)
N$54: E24.F1(F1:OUT) F23.E2(J2:IN2)
N$55: F23.F2(J2:IN3) F23.L1(L1:OUT)
N$56: F22.P2(S2:IN1) F22.S1(S1:OUT)
N$59: E24.H1(K1:IN1) E25.J1(J1:OUT)
OPR: E22.S2(S2:OUT) ; also sheet 5,6,7,27
OPR_: D40.D2 E21.V1(V1:OUT) E22.P2(S2:IN1)
SPECIAL_CYCLE_: E24.K1(K1:OUT) F23.M1(S1:IN1) F23.M2(P2:IN3)
TAD: E22.F1(F1:OUT) ; also sheet 5
TAD_: D40.T2 E21.D1(D1:OUT) E22.D1(F1:IN1) ; also sheet 7
TP1: E20.L2(P2:C) ; also sheet 2,3,7,8
TP2: E22.L1(N1:IN1) ; also sheet 2,7,8
TP4: E23.B1(E1:C) E23.D2(H2:C) E23.H1(L1:C) E23.L2(P2:C) E23.N1(S1:C) E23.S2(V2:C) E24.H2(K2:IN1) ; also sheet 2,7,8,29
TT_SET_: E25.E1(J1:IN1) ; also sheet 5,29
UF_: F11.D1(E1:IN4) ; also sheet 2,5,26
WC_SET: E23.M2(P2:D) F22.N2(N2:OUT)
WC_SET_: F22.L2(N2:IN1) F22.R1(S1:IN2) F22.V2(V2:OUT) ; also sheet 21
WORD_COUNT: E23.P1(S1:D) E23.P2 ; also sheet 5,6
WORD_COUNT_: D40.A1 E23.R2 E25.H1(J1:IN3) ; also sheet 8,21
Unconnected: A06.A1(C1:IN1) A06.B1(C1:IN2) A06.C1(C1:OUT) A06.H2(K2:IN1) A06.J2(K2:IN2) A06.K2(K2:OUT) E20.R2 E22.V2(V2:OUT) E23.E1 E23.L1 E24.V1

### Notes on the sheet
- 8i-00025/29/46?
- D-BS-8i-0-3 Instruction Register and Major States

## Sheet 5 of 40
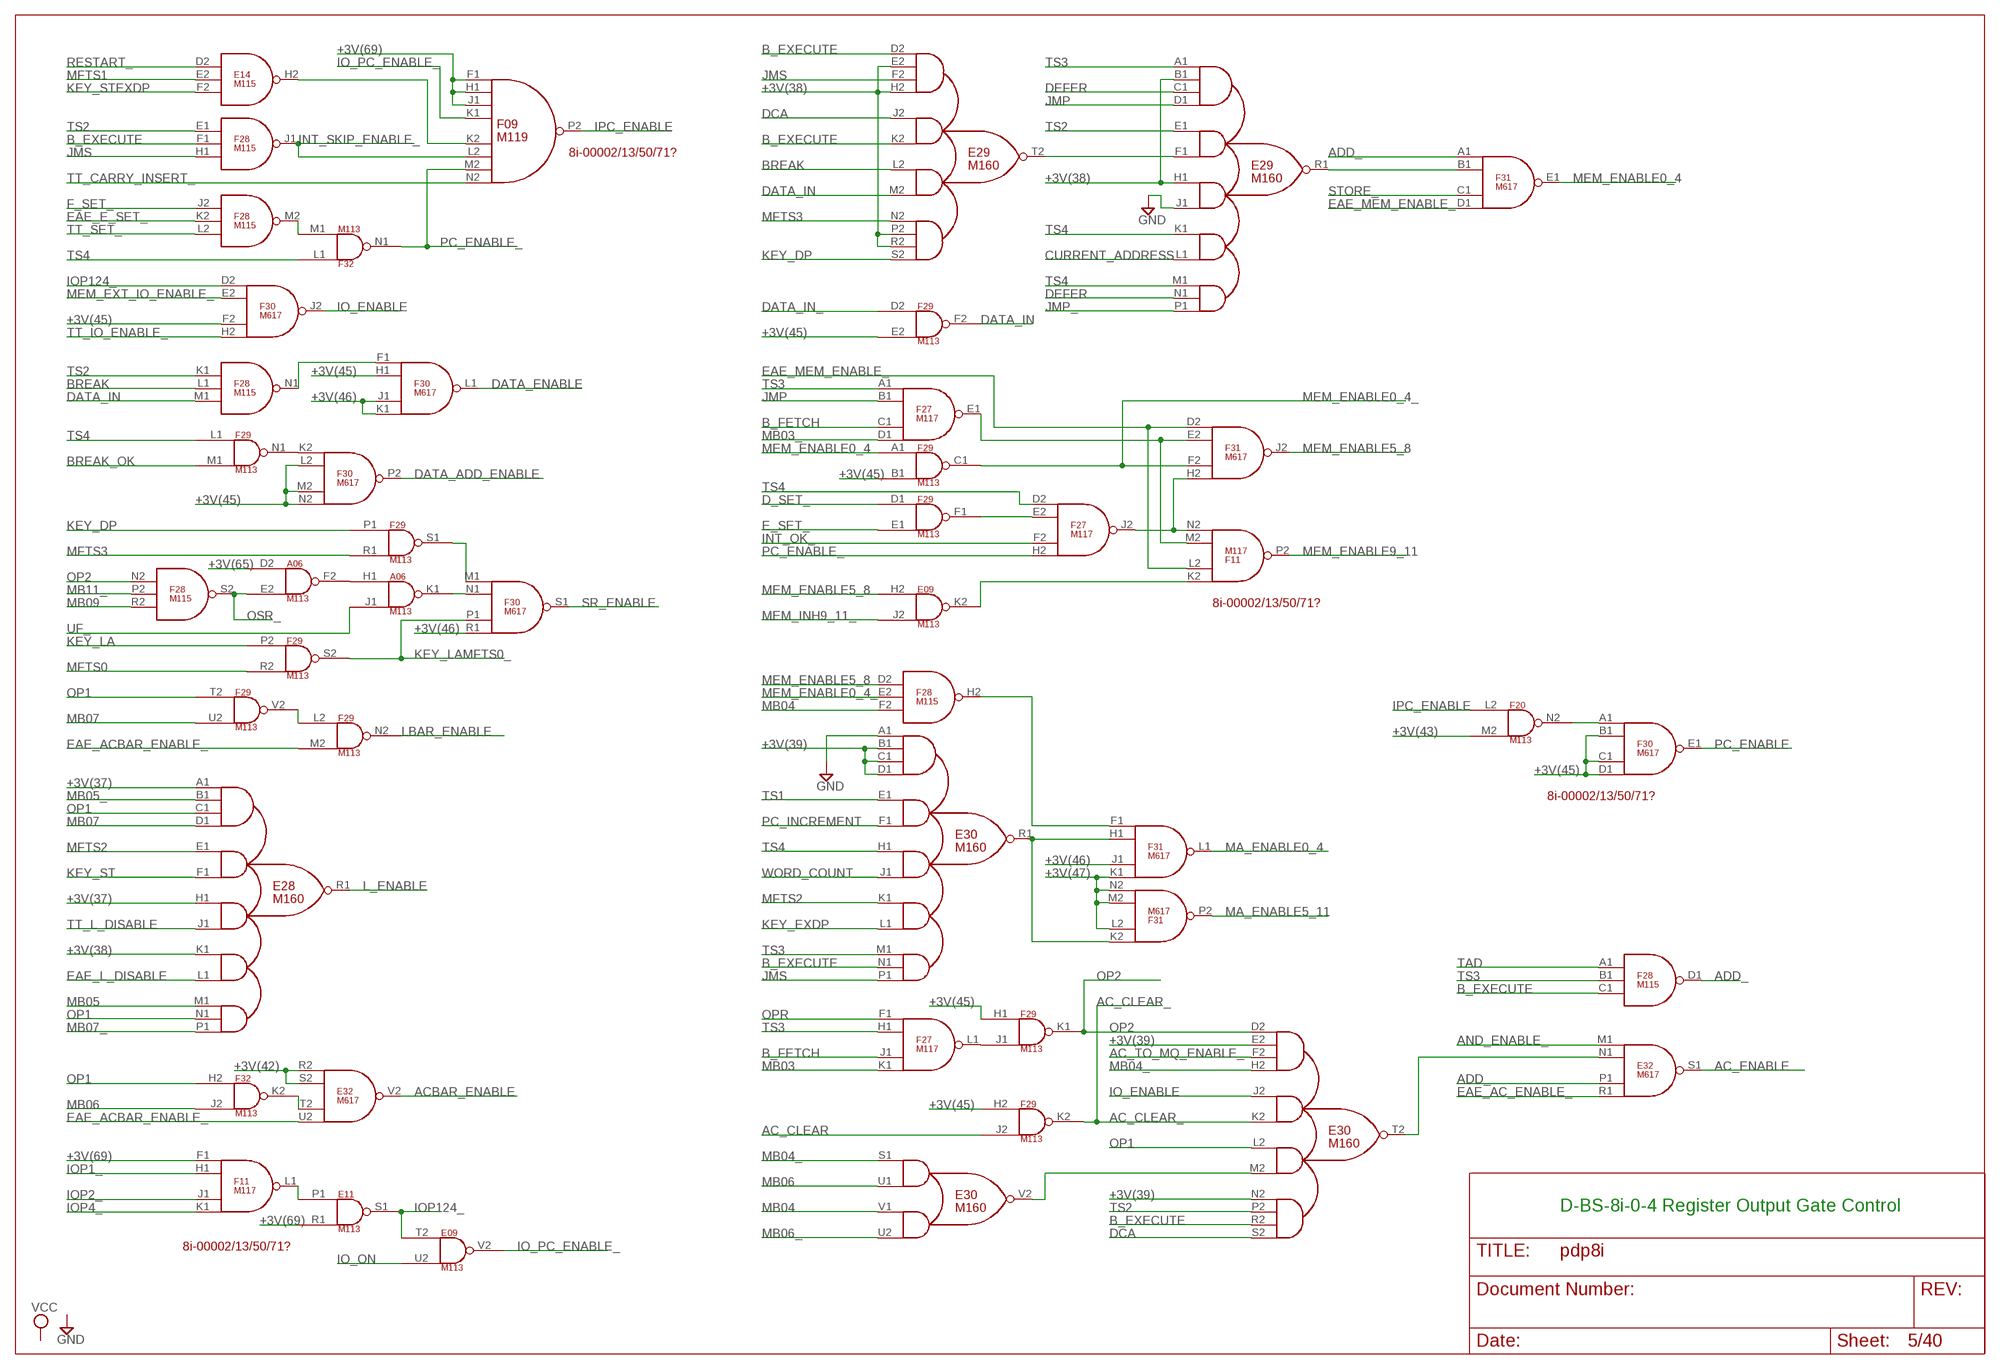
[diagram p4: schematic, sheet 5]

### Parts
E28  M160  [H807]
E29  M160  [H807]
E30  M160  [H807]
F09  M119  [H807]
F28  M115  [H807]
F32  M113  [H807]

### Nets
+3V(37): E28.A1(R1:IN1A) E28.H1(R1:IN3A) ; also sheet 1,6,7
+3V(38): E28.K1(R1:IN4A) E29.B1(R1:IN1B) E29.E2(T2:IN1B) E29.H1(R1:IN3A) E29.H2(T2:IN1D) E29.P2(T2:IN4B) E29.R2(T2:IN4C) ; also sheet 1
+3V(39): E30.B1(R1:IN1B) E30.C1(R1:IN1C) E30.D1(R1:IN1D) E30.E2(T2:IN1B) E30.N2(T2:IN4A) ; also sheet 1,6
+3V(42): E32.R2(V2:IN1) E32.S2(V2:IN2) ; also sheet 1,8,9,17
+3V(43): F20.M2(N2:IN2) ; also sheet 2,8,16
+3V(45): F29.B1(C1:IN2) F29.E2(F2:IN2) F29.H1(K1:IN1) F29.H2(K2:IN1) F30.B1(E1:IN2) F30.C1(E1:IN3) F30.D1(E1:IN4) F30.F2(J2:IN3) F30.H1(L1:IN2) F30.L2(P2:IN2) F30.M2(P2:IN3) F30.N2(P2:IN4) ; also sheet 1,7
+3V(46): F30.J1(L1:IN3) F30.K1(L1:IN4) F30.R1(S1:IN4) F31.J1(L1:IN3) ; also sheet 1,2,37
+3V(47): F31.K1(L1:IN4) F31.L2(P2:IN2) F31.M2(P2:IN3) F31.N2(P2:IN4) ; also sheet 4
+3V(65): A06.D2(F2:IN1) ; also sheet 4,26
+3V(69): E11.R1(S1:IN2) F09.F1(P2:IN1) F09.H1(P2:IN2) F09.J1(P2:IN3) F11.F1(L1:IN1) ; also sheet 6,8
AC_CLEAR: F29.J2(K2:IN2) ; also sheet 14
AC_CLEAR_: E30.K2(T2:IN2B) F29.K2(K2:OUT)
AC_ENABLE: E32.S1(S1:OUT) ; also sheet 10,11,12,13
AC_TO_MQ_ENABLE_: E30.F2(T2:IN1C) ; also sheet 27
ACBAR_ENABLE: E32.V2(V2:OUT) ; also sheet 10,11,12,13
ADD_: E32.P1(S1:IN3) F28.D1(D1:OUT) F31.A1(E1:IN1)
AND_ENABLE_: E32.M1(S1:IN1) ; also sheet 6
B_EXECUTE: E29.D2(T2:IN1A) E29.K2(T2:IN2B) E30.N1(R1:IN5B) E30.R2(T2:IN4C) F28.C1(D1:IN3) F28.F1(J1:IN2) ; also sheet 4,6,7,27
B_FETCH: F27.C1(E1:IN3) F27.J1(L1:IN3) ; also sheet 2,4,6,7,8,22,27,29
BREAK: E29.L2(T2:IN3A) F28.L1(N1:IN2) ; also sheet 4,6,8
BREAK_OK: F29.M1(N1:IN2) ; also sheet 4
CURRENT_ADDRESS: E29.L1(R1:IN4B) ; also sheet 4,6
D_SET_: F29.D1(F1:IN1) ; also sheet 4
DATA_ADD_ENABLE: F30.P2(P2:OUT) ; also sheet 10,11,12,13
DATA_ENABLE: F30.L1(L1:OUT) ; also sheet 10,11,12,13
DATA_IN: E29.M2(T2:IN3B) F28.M1(N1:IN3) F29.F2(F2:OUT)
DATA_IN_: F29.D2(F2:IN1) ; also sheet 14
DCA: E29.J2(T2:IN2A) E30.S2(T2:IN4D) ; also sheet 4
DEFER: E29.C1(R1:IN1C) E29.N1(R1:IN5B) ; also sheet 4,6,7,21
E_SET_: F29.E1(F1:IN2) ; also sheet 4,22
EAE_AC_ENABLE_: E32.R1(S1:IN4) ; also sheet 27
EAE_ACBAR_ENABLE_: E32.U2(V2:IN4) F29.M2(N2:IN2) ; also sheet 27
EAE_E_SET_: F28.K2(M2:IN2) ; also sheet 4,27
EAE_L_DISABLE: E28.L1(R1:IN4B) ; also sheet 27
EAE_MEM_ENABLE_: F11.L2(P2:IN2) F31.D1(E1:IN4) F31.D2(J2:IN1) ; also sheet 27
F_SET_: F28.J2(M2:IN1) ; also sheet 4,22
GND [Suppply]: E29.J1(R1:IN3B) E30.A1(R1:IN1A) ; also sheet 2,9,10,11,12,13,14,15,17,18,23,26,27,30,33,34,35,39
INT_OK_: F27.F2(J2:IN3) ; also sheet 4,8
INT_SKIP_ENABLE_: F09.L2(P2:IN6) F28.J1(J1:OUT) ; also sheet 6
IO_ENABLE: E30.J2(T2:IN2A) F30.J2(J2:OUT) ; also sheet 7,10,11,12,13
IO_ON: E09.U2(V2:IN2) ; also sheet 2
IO_PC_ENABLE_: E09.V2(V2:OUT) F09.K1(P2:IN4) ; also sheet 6
IOP1_: F11.H1(L1:IN2) ; also sheet 2,14,34,37
IOP2_: F11.J1(L1:IN3) ; also sheet 2,14,34,37
IOP4_: F11.K1(L1:IN4) ; also sheet 2,14,37
IOP124_: E09.T2(V2:IN1) E11.S1(S1:OUT) F30.D2(J2:IN1)
IPC_ENABLE: F09.P2(P2:OUT) F20.L2(N2:IN1)
JMP: E29.D1(R1:IN1D) F27.B1(E1:IN2) ; also sheet 4,7
JMP_: E29.P1(R1:IN5C) ; also sheet 4,21,22
JMS: E29.F2(T2:IN1C) E30.P1(R1:IN5C) F28.H1(J1:IN3) ; also sheet 4,6,7
KEY_DP: E29.S2(T2:IN4D) F29.P1(S1:IN1) ; also sheet 2
KEY_EXDP: E30.L1(R1:IN4B) ; also sheet 2,6
KEY_LA: F29.P2(S2:IN1) ; also sheet 2
KEY_LAMFTS0_: F29.S2(S2:OUT) F30.P1(S1:IN3) ; also sheet 22,26
KEY_ST: E28.F1(R1:IN2B) ; also sheet 2,4,7,8
KEY_STEXDP: E14.F2(H2:IN3) ; also sheet 2,7,21
L_ENABLE: E28.R1(R1:OUT) ; also sheet 9
LBAR_ENABLE: F29.N2(N2:OUT) ; also sheet 9
MA_ENABLE0_4: F31.L1(L1:OUT) ; also sheet 10,11
MA_ENABLE5_11: F31.P2(P2:OUT) ; also sheet 11,12,13
MB03: F27.K1(L1:IN4) ; also sheet 4,9,14,21,27,29,30,34,38
MB03_: F27.D1(E1:IN4) ; also sheet 4,6,7,8,9,14,15,16,18,22,23,30,32,33,35,36,37
MB04: E30.V1(V2:IN2A) F28.F2(H2:IN3) ; also sheet 9,14,21,22,30,38
MB04_: E30.H2(T2:IN1D) E30.S1(V2:IN1A) ; also sheet 8,9,14,15,16,18,23,27,29,30,32,33,34,35,36,37
MB05: E28.M1(R1:IN5A) ; also sheet 7,9,14,21,27,30,32,34,37
MB05_: E28.B1(R1:IN1B) ; also sheet 8,9,14,15,16,18,22,23,29,30,33,35,36,38
MB06: E30.U1(V2:IN1B) F32.J2(K2:IN2) ; also sheet 7,9,14,16,21,22,27,30,33,38
MB06_: E30.U2(V2:IN2B) ; also sheet 8,9,14,15,18,22,23,29,30,32,34,35,36,37,38
MB07: E28.D1(R1:IN1D) F29.U2(V2:IN2) ; also sheet 7,9,14,15,21,22,26,27,30,33,34,35,37,38
MB07_: E28.P1(R1:IN5C) ; also sheet 8,9,14,16,18,22,23,26,28,29,30,32,33,34,36
MB09: F28.R2(S2:IN3) ; also sheet 2,6,9,14,21,22,27,29,30,37
MB11_: F28.P2(S2:IN2) ; also sheet 2,7,8,9,18,22,23,26,28,29,30
MEM_ENABLE0_4: F29.A1(C1:IN1) F31.E1(E1:OUT) ; also sheet 6,10,11
MEM_ENABLE0_4_: F28.E2(H2:IN2) F29.C1(C1:OUT) F31.F2(J2:IN3)
MEM_ENABLE5_8: E09.H2(K2:IN1) F28.D2(H2:IN1) F31.J2(J2:OUT) ; also sheet 11,12
MEM_ENABLE9_11: F11.P2(P2:OUT) ; also sheet 13
MEM_EXT_IO_ENABLE_: F30.E2(J2:IN2) ; also sheet 22
MEM_INH9_11_: E09.J2(K2:IN2) ; also sheet 29
MFTS0: F29.R2(S2:IN2) ; also sheet 2
MFTS1: E14.E2(H2:IN2) ; also sheet 2
MFTS2: E28.E1(R1:IN2A) E30.K1(R1:IN4A) ; also sheet 2,6
MFTS3: E29.N2(T2:IN4A) F29.R1(S1:IN2) ; also sheet 2
N$57: E29.R1(R1:OUT) F31.B1(E1:IN2)
N$58: E09.K2(K2:OUT) F11.K2(P2:IN1)
N$60: F27.E2(J2:IN2) F29.F1(F1:OUT)
N$61: F11.M2(P2:IN3) F27.E1(E1:OUT) F31.E2(J2:IN2)
N$62: E30.R1(R1:OUT) F31.H1(L1:IN2) F31.K2(P2:IN1)
N$63: A06.F2(F2:OUT) A06.H1(K1:IN1)
N$64: E14.H2(H2:OUT) F09.K2(P2:IN5)
N$65: F28.M2(M2:OUT) F32.M1(N1:IN2)
N$66: F29.L2(N2:IN1) F29.V2(V2:OUT)
N$67: F28.N1(N1:OUT) F30.F1(L1:IN1)
N$68: E29.F1(R1:IN2B) E29.T2(T2:OUT)
N$69: F29.N1(N1:OUT) F30.K2(P2:IN1)
N$70: A06.K1(K1:OUT) F30.N1(S1:IN2)
N$71: F29.S1(S1:OUT) F30.M1(S1:IN1)
N$72: E32.T2(V2:IN3) F32.K2(K2:OUT)
N$73: F11.N2(P2:IN4) F27.J2(J2:OUT) F31.H2(J2:IN4)
N$74: F28.H2(H2:OUT) F31.F1(L1:IN1)
N$76: F27.L1(L1:OUT) F29.J1(K1:IN2)
N$79: E30.T2(T2:OUT) E32.N1(S1:IN2)
N$84: E30.M2(T2:IN3B) E30.V2(V2:OUT)
N$120: E11.P1(S1:IN1) F11.L1(L1:OUT)
N$749: F20.N2(N2:OUT) F30.A1(E1:IN1)
OP1: E28.C1(R1:IN1C) E28.N1(R1:IN5B) E30.L2(T2:IN3A) F29.T2(V2:IN1) F32.H2(K2:IN1) ; also sheet 6
OP2: E30.D2(T2:IN1A) F28.N2(S2:IN1) F29.K1(K1:OUT) ; also sheet 2,7,26,27
OPR: F27.F1(L1:IN1) ; also sheet 4,6,7,27
OSR_: A06.E2(F2:IN2) F28.S2(S2:OUT)
PC_ENABLE: F30.E1(E1:OUT) ; also sheet 10,11,12,13
PC_ENABLE_: F09.M2(P2:IN7) F27.H2(J2:IN4) F32.N1(N1:OUT) ; also sheet 6
PC_INCREMENT: E30.F1(R1:IN2B) ; also sheet 6,7
RESTART_: E14.D2(H2:IN1) ; also sheet 2,32
SR_ENABLE: F30.S1(S1:OUT) ; also sheet 10,11,12,13,22
STORE_: F31.C1(E1:IN3) ; also sheet 29
TAD: F28.A1(D1:IN1) ; also sheet 4
TS1: E30.E1(R1:IN2A) ; also sheet 2,6,29
TS2: E29.E1(R1:IN2A) E30.P2(T2:IN4B) F28.E1(J1:IN1) F28.K1(N1:IN1) ; also sheet 2,6,7,29
TS3: E29.A1(R1:IN1A) E30.M1(R1:IN5A) F27.A1(E1:IN1) F27.H1(L1:IN2) F28.B1(D1:IN2) ; also sheet 2,6,22,29
TS4: E29.K1(R1:IN4A) E29.M1(R1:IN5A) E30.H1(R1:IN3A) F27.D2(J2:IN1) F29.L1(N1:IN1) F32.L1(N1:IN1) ; also sheet 2,8
TT_CARRY_INSERT_: F09.N2(P2:IN8) ; also sheet 6,29
TT_IO_ENABLE_: F30.H2(J2:IN4) ; also sheet 29
TT_L_DISABLE: E28.J1(R1:IN3B) ; also sheet 29
TT_SET_: F28.L2(M2:IN3) ; also sheet 4,29
UF_: A06.J1(K1:IN2) ; also sheet 2,4,26
WORD_COUNT: E30.J1(R1:IN3B) ; also sheet 4,6
Unconnected: E28.S1(V2:IN1A) E28.U1(V2:IN1B) E28.U2(V2:IN2B) E28.V1(V2:IN2A) E28.V2(V2:OUT) E29.S1(V2:IN1A) E29.U1(V2:IN1B) E29.U2(V2:IN2B) E29.V1(V2:IN2A) E29.V2(V2:OUT) F09.M1(V2:IN1) F09.N1(V2:IN2) F09.P1(V2:IN3) F09.R1(V2:IN4) F09.R2(V2:IN5) F09.S2(V2:IN6) F09.T2(V2:IN7) F09.U2(V2:IN8) F09.V2(V2:OUT) F32.U1 F32.V1

### Notes on the sheet
- 8i-00002/13/50/71?
- 8i-00002/13/50/71?
- 8i-00002/13/50/71?
- D-BS-8i-0-4 Register Output Gate Control
- 8i-00002/13/50/71?

## Sheet 6 of 40
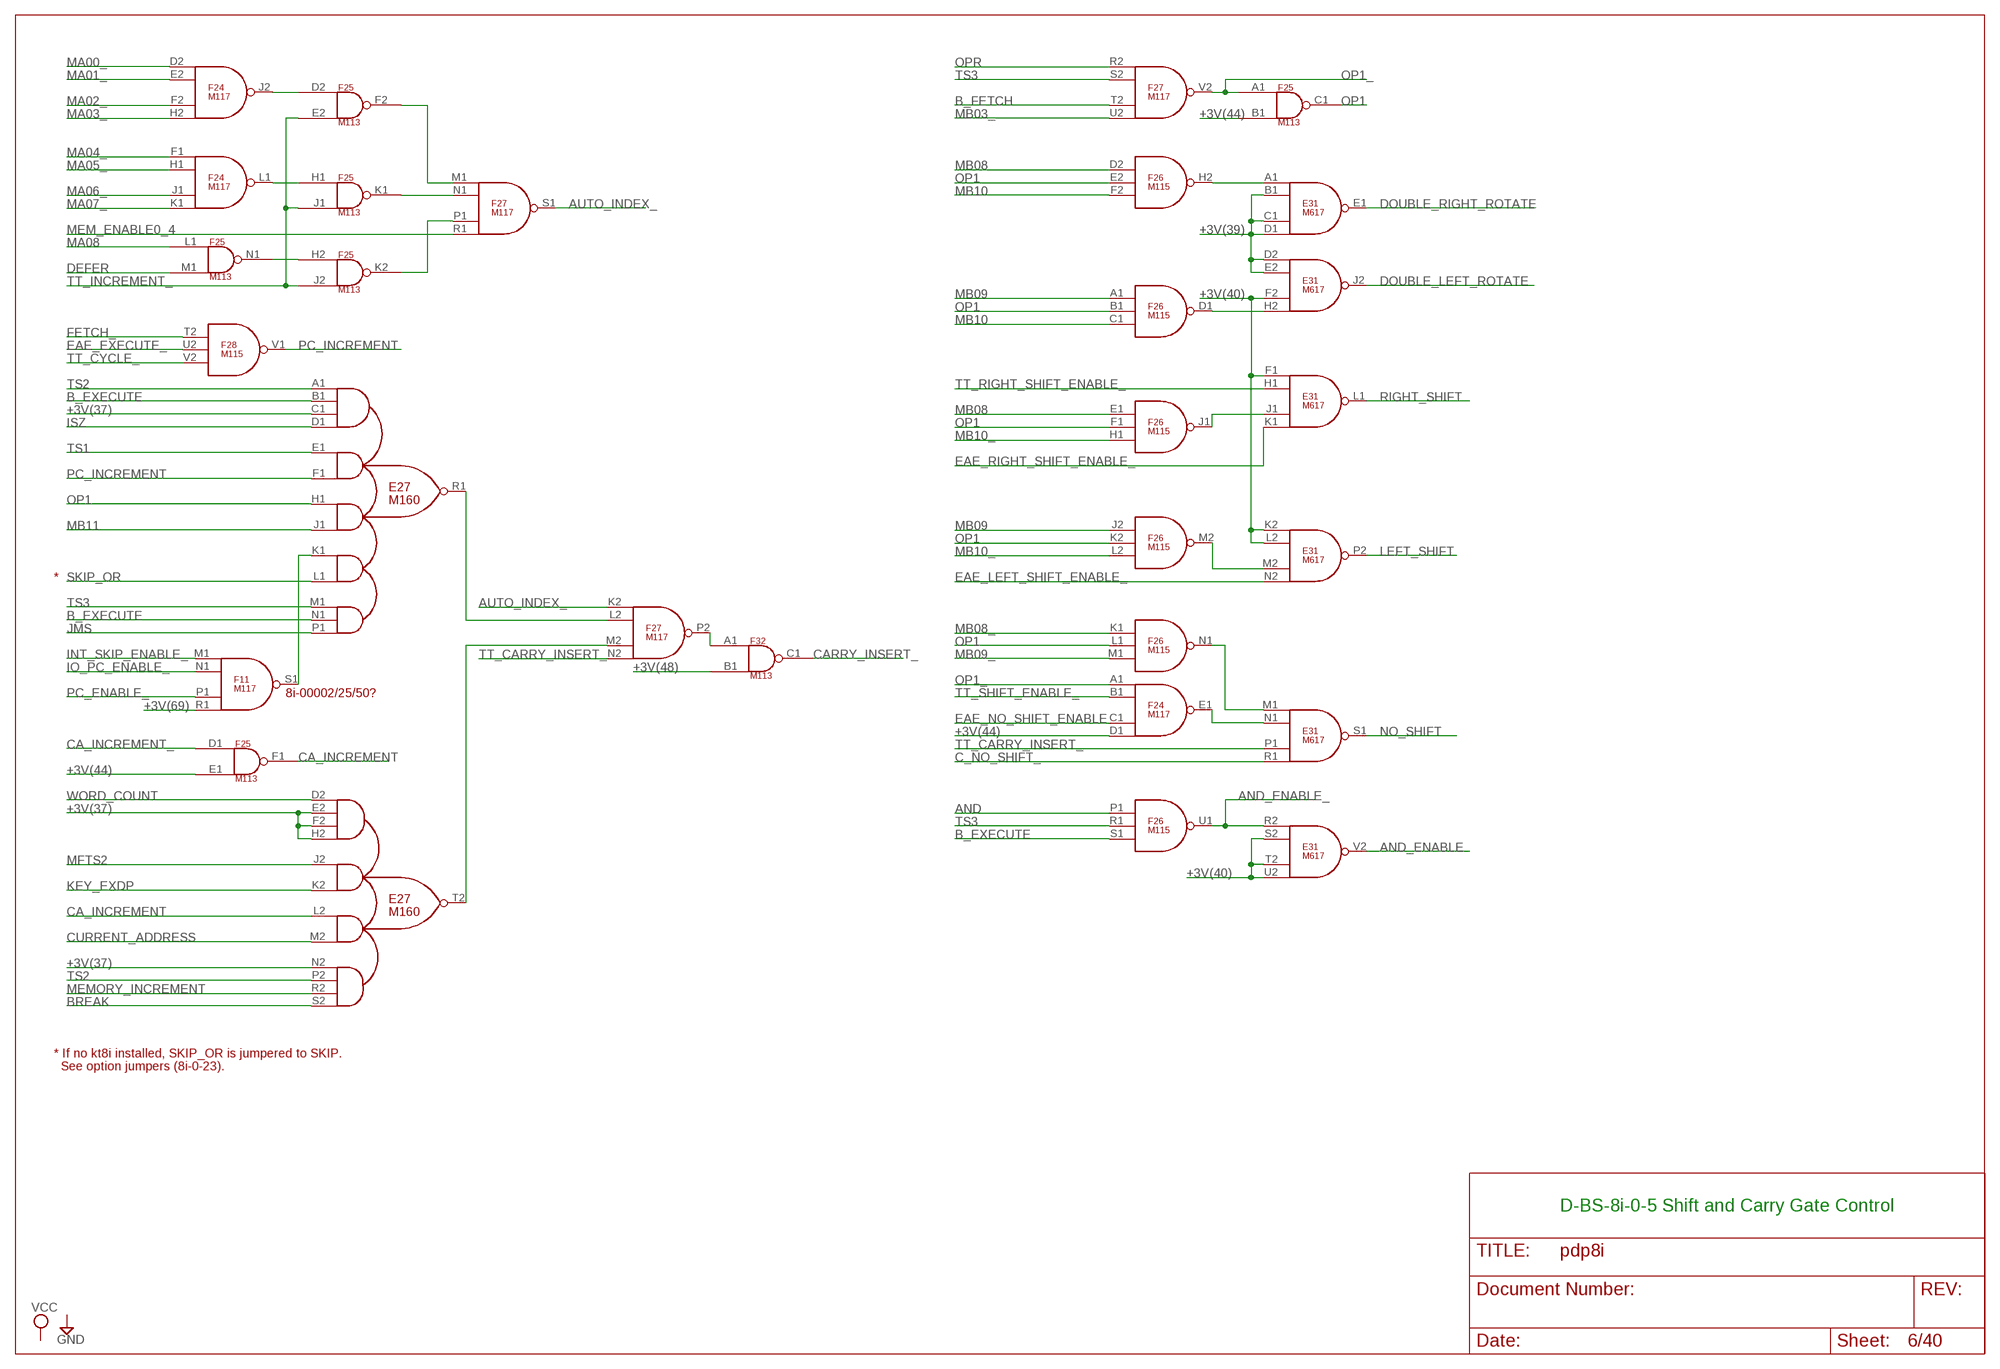
[diagram p5: schematic, sheet 6]

### Parts
E27  M160  [H807]
F24  M117  [H807]
F25  M113  [H807]
F26  M115  [H807]

### Nets
+3V(37): E27.C1(R1:IN1C) E27.E2(T2:IN1B) E27.F2(T2:IN1C) E27.H2(T2:IN1D) E27.N2(T2:IN4A) ; also sheet 1,5,7
+3V(39): E31.B1(E1:IN2) E31.C1(E1:IN3) E31.D1(E1:IN4) E31.D2(J2:IN1) E31.E2(J2:IN2) ; also sheet 1,5
+3V(40): E31.F1(L1:IN1) E31.F2(J2:IN3) E31.K2(P2:IN1) E31.L2(P2:IN2) E31.S2(V2:IN2) E31.T2(V2:IN3) E31.U2(V2:IN4) ; also sheet 1
+3V(44): F24.D1(E1:IN4) F25.B1(C1:IN2) F25.E1(F1:IN2) ; also sheet 4,7
+3V(48): F32.B1(C1:IN2) ; also sheet 1,7,9
+3V(69): F11.R1(S1:IN4) ; also sheet 5,8
AND: F26.P1(U1:IN1) ; also sheet 4
AND_ENABLE: E31.V2(V2:OUT) ; also sheet 10,11,12,13
AND_ENABLE_: E31.R2(V2:IN1) F26.U1(U1:OUT) ; also sheet 5
AUTO_INDEX_: F27.K2(P2:IN1) F27.S1(S1:OUT)
B_EXECUTE: E27.B1(R1:IN1B) E27.N1(R1:IN5B) F26.S1(U1:IN3) ; also sheet 4,5,7,27
B_FETCH: F27.T2(V2:IN3) ; also sheet 2,4,5,7,8,22,27,29
BREAK: E27.S2(T2:IN4D) ; also sheet 4,5,8
C_NO_SHIFT_: E31.R1(S1:IN4) ; also sheet 29
CA_INCREMENT: E27.L2(T2:IN3A) F25.F1(F1:OUT)
CA_INCREMENT_: F25.D1(F1:IN1) ; also sheet 14
CARRY_INSERT_: F32.C1(C1:OUT) ; also sheet 13
CURRENT_ADDRESS: E27.M2(T2:IN3B) ; also sheet 4,5
DEFER: F25.M1(N1:IN2) ; also sheet 4,5,7,21
DOUBLE_LEFT_ROTATE: E31.J2(J2:OUT) ; also sheet 9,10,11,12,13
DOUBLE_RIGHT_ROTATE: E31.E1(E1:OUT) ; also sheet 9,10,11,12,13
EAE_EXECUTE_: F28.U2(V1:IN2) ; also sheet 27
EAE_LEFT_SHIFT_ENABLE_: E31.N2(P2:IN4) ; also sheet 27
EAE_NO_SHIFT_ENABLE: F24.C1(E1:IN3) ; also sheet 27
EAE_RIGHT_SHIFT_ENABLE_: E31.K1(L1:IN4) ; also sheet 27,28
FETCH_: F28.T2(V1:IN1) ; also sheet 4
INT_SKIP_ENABLE_: F11.M1(S1:IN1) ; also sheet 5
IO_PC_ENABLE_: F11.N1(S1:IN2) ; also sheet 5
ISZ: E27.D1(R1:IN1D) ; also sheet 4,7
JMS: E27.P1(R1:IN5C) ; also sheet 4,5,7
KEY_EXDP: E27.K2(T2:IN2B) ; also sheet 2,5
LEFT_SHIFT: E31.P2(P2:OUT) ; also sheet 9,10,11,12,13
MA00_: F24.D2(J2:IN1) ; also sheet 9,19,21,24
MA01_: F24.E2(J2:IN2) ; also sheet 9,21
MA02_: F24.F2(J2:IN3) ; also sheet 9,21
MA03_: F24.H2(J2:IN4) ; also sheet 9,19,21,24
MA04_: F24.F1(L1:IN1) ; also sheet 9,21
MA05_: F24.H1(L1:IN2) ; also sheet 9,21
MA06_: F24.J1(L1:IN3) ; also sheet 9,20,21,25
MA07_: F24.K1(L1:IN4) ; also sheet 9,21
MA08: F25.L1(N1:IN1) ; also sheet 9,20,25
MB03_: F27.U2(V2:IN4) ; also sheet 4,5,7,8,9,14,15,16,18,22,23,30,32,33,35,36,37
MB08: F26.D2(H2:IN1) F26.E1(J1:IN1) ; also sheet 7,9,14,15,21,22,26,27,30,33,34,36,37,38
MB08_: F26.K1(N1:IN1) ; also sheet 7,8,9,14,16,18,22,23,26,28,29,30,32,33,34,35
MB09: F26.A1(D1:IN1) F26.J2(M2:IN1) ; also sheet 2,5,9,14,21,22,27,29,30,37
MB09_: F26.M1(N1:IN3) ; also sheet 9,18,23,26,27,28,30,33,37
MB10: F26.C1(D1:IN3) F26.F2(H2:IN3) ; also sheet 2,8,9,14,21,22,27,29,30,33,37
MB10_: F26.H1(J1:IN3) F26.L2(M2:IN3) ; also sheet 8,9,18,22,23,26,27,28,30,37
MB11: E27.J1(R1:IN3B) ; also sheet 2,9,14,21,22,27,29,30,33,37
MEM_ENABLE0_4: F27.R1(S1:IN4) ; also sheet 5,10,11
MEMORY_INCREMENT: E27.R2(T2:IN4C) ; also sheet 8,14
MFTS2: E27.J2(T2:IN2A) ; also sheet 2,5
N$75: F25.H2(K2:IN1) F25.N1(N1:OUT)
N$77: F24.L1(L1:OUT) F25.H1(K1:IN1)
N$78: F24.J2(J2:OUT) F25.D2(F2:IN1)
N$80: E27.K1(R1:IN4A) F11.S1(S1:OUT)
N$81: E27.T2(T2:OUT) F27.M2(P2:IN3)
N$82: E27.R1(R1:OUT) F27.L2(P2:IN2)
N$83: E31.N1(S1:IN2) F24.E1(E1:OUT)
N$85: F25.K2(K2:OUT) F27.P1(S1:IN3)
N$86: F25.K1(K1:OUT) F27.N1(S1:IN2)
N$87: F25.F2(F2:OUT) F27.M1(S1:IN1)
N$88: E31.M1(S1:IN1) F26.N1(N1:OUT)
N$89: F27.P2(P2:OUT) F32.A1(C1:IN1)
N$90: E31.H2(J2:IN4) F26.D1(D1:OUT)
N$91: E31.J1(L1:IN3) F26.J1(J1:OUT)
N$92: E31.M2(P2:IN3) F26.M2(M2:OUT)
N$94: E31.A1(E1:IN1) F26.H2(H2:OUT)
NO_SHIFT: E31.S1(S1:OUT) ; also sheet 9,10,11,12,13
OP1: E27.H1(R1:IN3A) F25.C1(C1:OUT) F26.B1(D1:IN2) F26.E2(H2:IN2) F26.F1(J1:IN2) F26.K2(M2:IN2) F26.L1(N1:IN2) ; also sheet 5
OP1_: F24.A1(E1:IN1) F25.A1(C1:IN1) F27.V2(V2:OUT)
OPR: F27.R2(V2:IN1) ; also sheet 4,5,7,27
PC_ENABLE_: F11.P1(S1:IN3) ; also sheet 5
PC_INCREMENT: E27.F1(R1:IN2B) F28.V1(V1:OUT) ; also sheet 5,7
RIGHT_SHIFT: E31.L1(L1:OUT) ; also sheet 9,10,11,12,13,28
SKIP_OR: E27.L1(R1:IN4B) ; also sheet 26
TS1: E27.E1(R1:IN2A) ; also sheet 2,5,29
TS2: E27.A1(R1:IN1A) E27.P2(T2:IN4B) ; also sheet 2,5,7,29
TS3: E27.M1(R1:IN5A) F26.R1(U1:IN2) F27.S2(V2:IN2) ; also sheet 2,5,22,29
TT_CARRY_INSERT_: E31.P1(S1:IN3) F27.N2(P2:IN4) ; also sheet 5,29
TT_CYCLE_: F28.V2(V1:IN3) ; also sheet 29
TT_INCREMENT_: F25.E2(F2:IN2) F25.J1(K1:IN2) F25.J2(K2:IN2) ; also sheet 29
TT_RIGHT_SHIFT_ENABLE_: E31.H1(L1:IN2) ; also sheet 29
TT_SHIFT_ENABLE_: F24.B1(E1:IN2) ; also sheet 29
WORD_COUNT: E27.D2(T2:IN1A) ; also sheet 4,5
Unconnected: E27.S1(V2:IN1A) E27.U1(V2:IN1B) E27.U2(V2:IN2B) E27.V1(V2:IN2A) E27.V2(V2:OUT) F24.U1 F24.V1 F25.U1 F25.V1

### Notes on the sheet
- *
- 8i-00002/25/50?
- * If no kt8i installed, SKIP_OR is jumpered to SKIP.
- See option jumpers (8i-0-23).
- D-BS-8i-0-5 Shift and Carry Gate Control

## Sheet 7 of 40
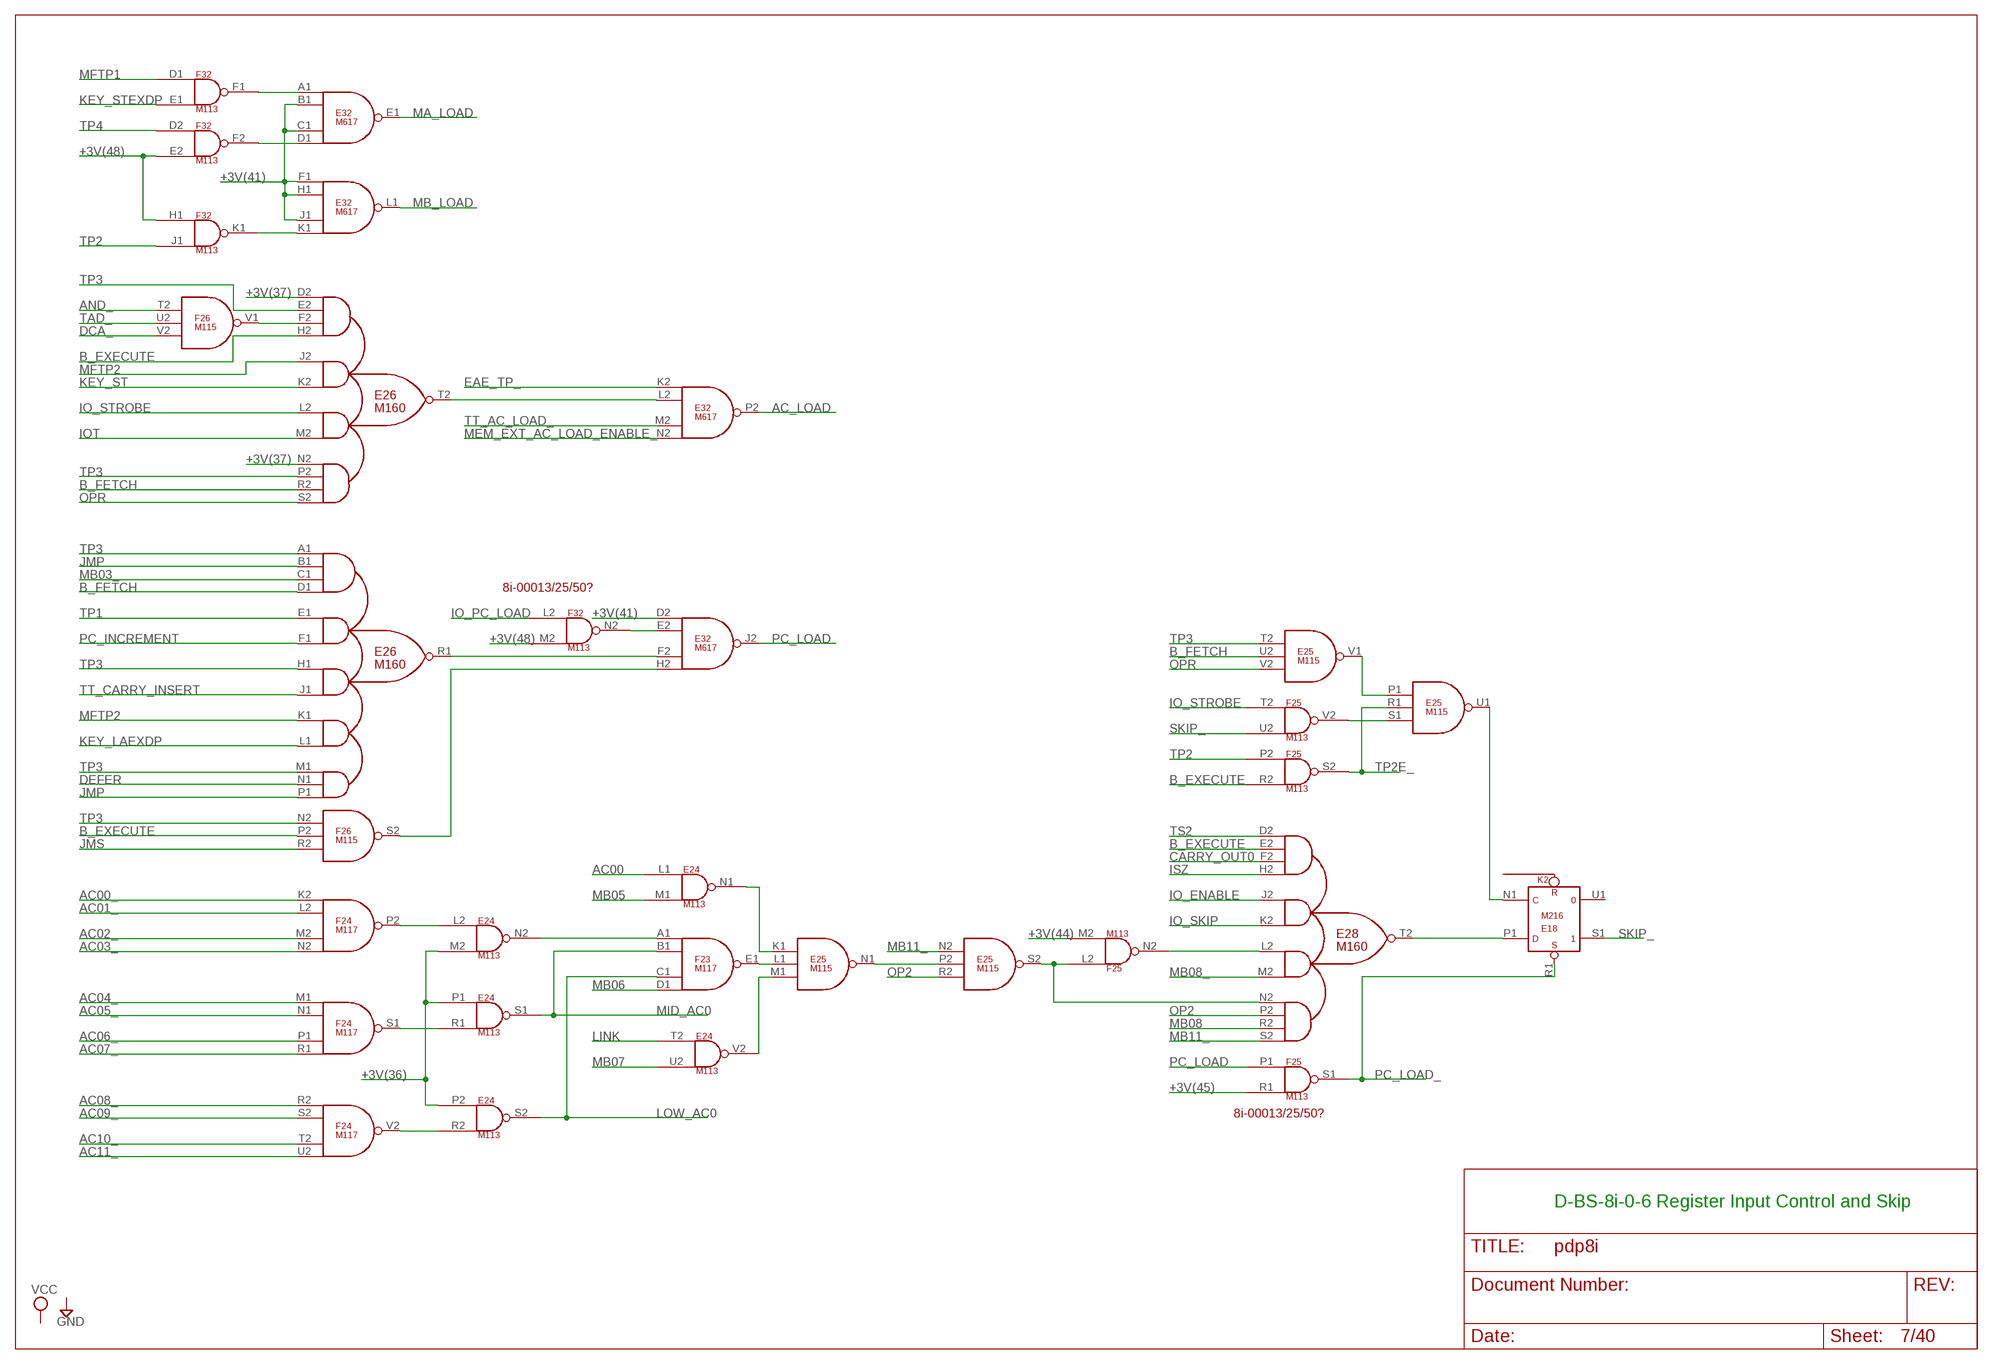
[diagram p6: schematic, sheet 7]

### Parts
E26  M160  [H807]

### Nets
+3V(36): E24.M2(N2:IN2) E24.P1(S1:IN1) E24.P2(S2:IN1) ; also sheet 4
+3V(37): E26.D2(T2:IN1A) E26.N2(T2:IN4A) ; also sheet 1,5,6
+3V(41): E32.B1(E1:IN2) E32.C1(E1:IN3) E32.D2(J2:IN1) E32.F1(L1:IN1) E32.H1(L1:IN2) E32.J1(L1:IN3) ; also sheet 1
+3V(44): F25.M2(N2:IN2) ; also sheet 4,6
+3V(45): F25.R1(S1:IN2) ; also sheet 1,5
+3V(48): F32.E2(F2:IN2) F32.H1(K1:IN1) F32.M2(N2:IN2) ; also sheet 1,6,9
AC00: E24.L1(N1:IN1) ; also sheet 9,14,27,28,37
AC00_: F24.K2(P2:IN1) ; also sheet 9,27
AC01_: F24.L2(P2:IN2) ; also sheet 9,27
AC02_: F24.M2(P2:IN3) ; also sheet 9,27
AC03_: F24.N2(P2:IN4) ; also sheet 9,27
AC04_: F24.M1(S1:IN1) ; also sheet 9
AC05_: F24.N1(S1:IN2) ; also sheet 9
AC06_: F24.P1(S1:IN3) ; also sheet 9
AC07_: F24.R1(S1:IN4) ; also sheet 9
AC08_: F24.R2(V2:IN1) ; also sheet 9
AC09_: F24.S2(V2:IN2) ; also sheet 9
AC10_: F24.T2(V2:IN3) ; also sheet 9
AC11_: F24.U2(V2:IN4) ; also sheet 9
AC_LOAD: E32.P2(P2:OUT) ; also sheet 9
AND_: F26.T2(V1:IN1) ; also sheet 4
B_EXECUTE: E26.H2(T2:IN1D) E28.E2(T2:IN1B) F25.R2(S2:IN2) F26.P2(S2:IN2) ; also sheet 4,5,6,27
B_FETCH: E25.U2(V1:IN2) E26.D1(R1:IN1D) E26.R2(T2:IN4C) ; also sheet 2,4,5,6,8,22,27,29
CARRY_OUT0: E28.F2(T2:IN1C) ; also sheet 8,9
DCA_: F26.V2(V1:IN3) ; also sheet 4
DEFER: E26.N1(R1:IN5B) ; also sheet 4,5,6,21
EAE_TP_: E32.K2(P2:IN1) ; also sheet 27,28
IO_ENABLE: E28.J2(T2:IN2A) ; also sheet 5,10,11,12,13
IO_PC_LOAD: F32.L2(N2:IN1) ; also sheet 1
IO_SKIP: E28.K2(T2:IN2B) ; also sheet 14
IO_STROBE: E26.L2(T2:IN3A) F25.T2(V2:IN1) ; also sheet 2
IOT: E26.M2(T2:IN3B) ; also sheet 2,4,8,22,29
ISZ: E28.H2(T2:IN1D) ; also sheet 4,6
JMP: E26.B1(R1:IN1B) E26.P1(R1:IN5C) ; also sheet 4,5
JMS: F26.R2(S2:IN3) ; also sheet 4,5,6
KEY_LAEXDP: E26.L1(R1:IN4B) ; also sheet 2
KEY_ST: E26.K2(T2:IN2B) ; also sheet 2,4,5,8
KEY_STEXDP: F32.E1(F1:IN2) ; also sheet 2,5,21
LINK: E24.T2(V2:IN1) ; also sheet 9
LOW_AC0: E24.S2(S2:OUT) F23.C1(E1:IN3) ; also sheet 27
MA_LOAD: E32.E1(E1:OUT) ; also sheet 9
MB03_: E26.C1(R1:IN1C) ; also sheet 4,5,6,8,9,14,15,16,18,22,23,30,32,33,35,36,37
MB05: E24.M1(N1:IN2) ; also sheet 5,9,14,21,27,30,32,34,37
MB06: F23.D1(E1:IN4) ; also sheet 5,9,14,16,21,22,27,30,33,38
MB07: E24.U2(V2:IN2) ; also sheet 5,9,14,15,21,22,26,27,30,33,34,35,37,38
MB08: E28.R2(T2:IN4C) ; also sheet 6,9,14,15,21,22,26,27,30,33,34,36,37,38
MB08_: E28.M2(T2:IN3B) ; also sheet 6,8,9,14,16,18,22,23,26,28,29,30,32,33,34,35
MB11_: E25.N2(S2:IN1) E28.S2(T2:IN4D) ; also sheet 2,5,8,9,18,22,23,26,28,29,30
MB_LOAD: E32.L1(L1:OUT) ; also sheet 9
MEM_EXT_AC_LOAD_ENABLE_: E32.N2(P2:IN4) ; also sheet 22
MFTP1: F32.D1(F1:IN1) ; also sheet 2,21
MFTP2: E26.J2(T2:IN2A) E26.K1(R1:IN4A) ; also sheet 2,4,8
MID_AC0: E24.S1(S1:OUT) F23.B1(E1:IN2) ; also sheet 27
N$93: E26.F2(T2:IN1C) F26.V1(V1:OUT)
N$95: E26.T2(T2:OUT) E32.L2(P2:IN2)
N$96: E26.R1(R1:OUT) E32.F2(J2:IN3)
N$97: E32.H2(J2:IN4) F26.S2(S2:OUT)
N$98: E24.R2(S2:IN2) F24.V2(V2:OUT)
N$99: E24.R1(S1:IN2) F24.S1(S1:OUT)
N$100: E24.L2(N2:IN1) F24.P2(P2:OUT)
N$101: E25.L1(N1:IN2) F23.E1(E1:OUT)
N$102: E24.V2(V2:OUT) E25.M1(N1:IN3)
N$103: E24.N2(N2:OUT) F23.A1(E1:IN1)
N$104: E24.N1(N1:OUT) E25.K1(N1:IN1)
N$105: E25.N1(N1:OUT) E25.P2(S2:IN2)
N$106: E28.L2(T2:IN3A) F25.N2(N2:OUT)
N$107: E25.S2(S2:OUT) E28.N2(T2:IN4A) F25.L2(N2:IN1)
N$108: E18.P1(S1:D) E28.T2(T2:OUT)
N$109: E32.D1(E1:IN4) F32.F2(F2:OUT)
N$110: E32.A1(E1:IN1) F32.F1(F1:OUT)
N$111: E18.N1(S1:C) E25.U1(U1:OUT)
N$112: E32.K1(L1:IN4) F32.K1(K1:OUT)
N$113: E25.P1(U1:IN1) E25.V1(V1:OUT)
N$115: E25.S1(U1:IN3) F25.V2(V2:OUT)
N$750: E32.E2(J2:IN2) F32.N2(N2:OUT)
OP2: E25.R2(S2:IN3) E28.P2(T2:IN4B) ; also sheet 2,5,26,27
OPR: E25.V2(V1:IN3) E26.S2(T2:IN4D) ; also sheet 4,5,6,27
PC_INCREMENT: E26.F1(R1:IN2B) ; also sheet 5,6
PC_LOAD: E32.J2(J2:OUT) F25.P1(S1:IN1) ; also sheet 9,22
PC_LOAD_: E18.R1(S1:S) F25.S1(S1:OUT) ; also sheet 26
SKIP_: E18.S1 F25.U2(V2:IN2) ; also sheet 26
TAD_: F26.U2(V1:IN2) ; also sheet 4
TP1: E26.E1(R1:IN2A) ; also sheet 2,3,4,8
TP2: F25.P2(S2:IN1) F32.J1(K1:IN2) ; also sheet 2,4,8
TP2E_: E25.R1(U1:IN2) F25.S2(S2:OUT) ; also sheet 26
TP3: E25.T2(V1:IN1) E26.A1(R1:IN1A) E26.E2(T2:IN1B) E26.H1(R1:IN3A) E26.M1(R1:IN5A) E26.P2(T2:IN4B) F26.N2(S2:IN1) ; also sheet 2,21,22,26,27,29,30
TP4: F32.D2(F2:IN1) ; also sheet 2,4,8,29
TS2: E28.D2(T2:IN1A) ; also sheet 2,5,6,29
TT_AC_LOAD_: E32.M2(P2:IN3) ; also sheet 29
TT_CARRY_INSERT: E26.J1(R1:IN3B) ; also sheet 29
Unconnected: E18.U1

### Notes on the sheet
- 8i-00013/25/50?
- 8i-00013/25/50?
- D-BS-8i-0-6 Register Input Control and Skip

## Sheet 8 of 40
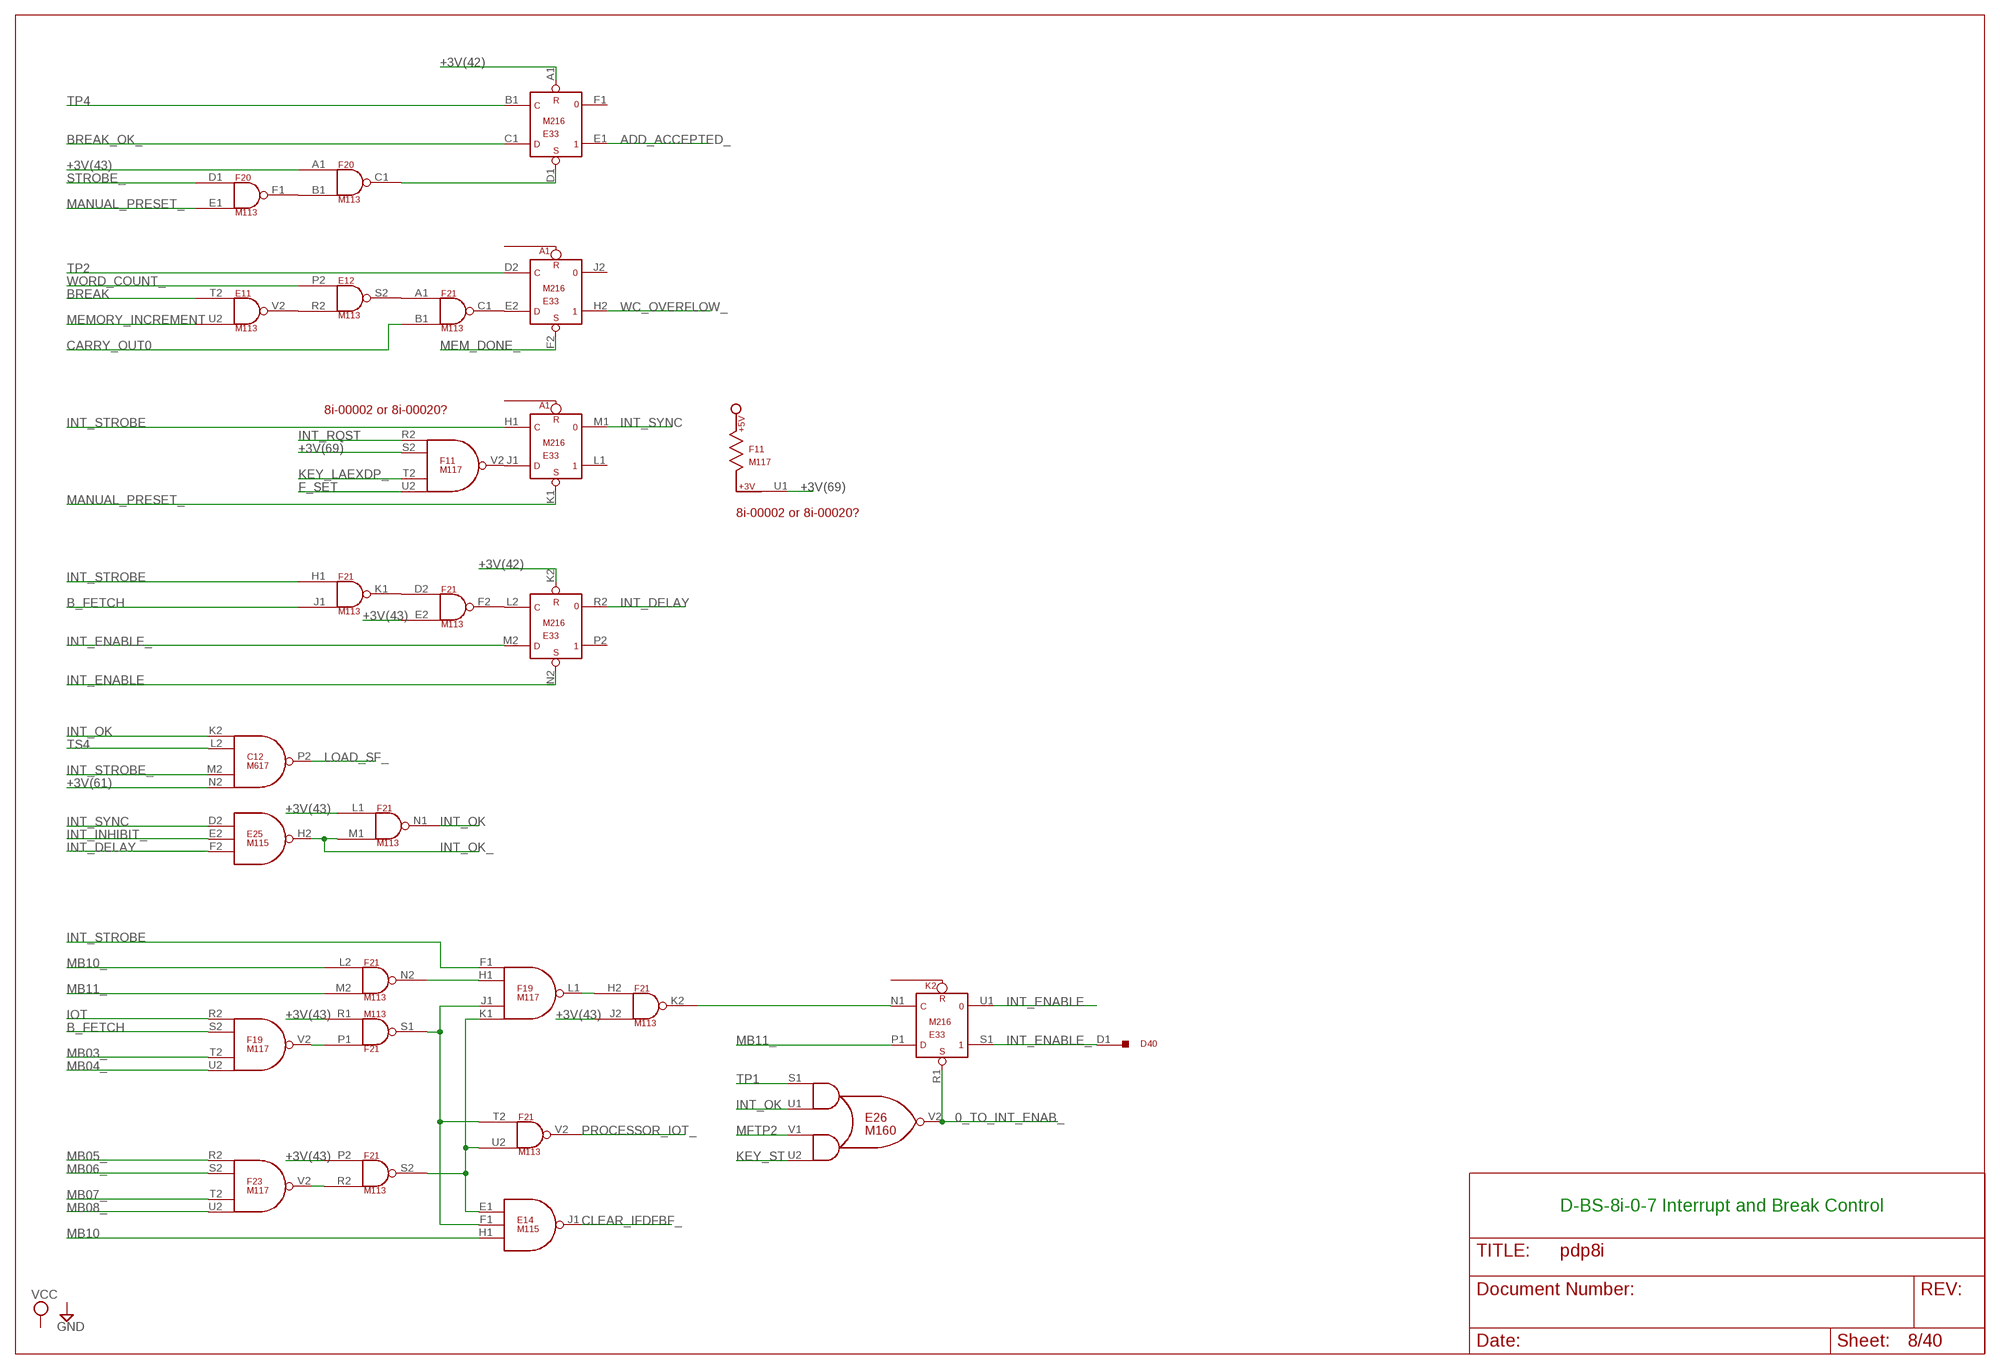
[diagram p7: schematic, sheet 8]

### Parts
E33  M216  M206X  [H807]

### Nets
0_TO_INT_ENAB_: E26.V2(V2:OUT) E33.R1(S1:S)
+3V(42): E33.A1(E1:R) E33.K2(P2:R) ; also sheet 1,5,9,17
+3V(43): F20.A1(C1:IN1) F21.E2(F2:IN2) F21.J2(K2:IN2) F21.L1(N1:IN1) F21.P2(S2:IN1) F21.R1(S1:IN2) ; also sheet 2,5,16
+3V(61): C12.N2(P2:IN4) ; also sheet 2,17
+3V(69): F11.S2(V2:IN2) F11.U1 ; also sheet 5,6
ADD_ACCEPTED_: E33.E1 ; also sheet 14
B_FETCH: F19.S2(V2:IN2) F21.J1(K1:IN2) ; also sheet 2,4,5,6,7,22,27,29
BREAK: E11.T2(V2:IN1) ; also sheet 4,5,6
BREAK_OK_: E33.C1(E1:D) ; also sheet 4
CARRY_OUT0: F21.B1(C1:IN2) ; also sheet 7,9
CLEAR_IFDFBF_: E14.J1(J1:OUT) ; also sheet 21
F_SET: F11.U2(V2:IN4) ; also sheet 2,4
INT_DELAY: E25.F2(H2:IN3) E33.R2
INT_ENABLE: E33.N2(P2:S) E33.U1
INT_ENABLE_: D40.D1 E33.M2(P2:D) E33.S1
INT_INHIBIT_: E25.E2(H2:IN2) ; also sheet 22
INT_OK: C12.K2(P2:IN1) E26.U1(V2:IN1B) F21.N1(N1:OUT) ; also sheet 4
INT_OK_: E25.H2(H2:OUT) F21.M1(N1:IN2) ; also sheet 4,5
INT_RQST: F11.R2(V2:IN1) ; also sheet 14
INT_STROBE: E33.H1(L1:C) F19.F1(L1:IN1) F21.H1(K1:IN1) ; also sheet 2
INT_STROBE_: C12.M2(P2:IN3) ; also sheet 2
INT_SYNC: E25.D2(H2:IN1) E33.M1
IOT: F19.R2(V2:IN1) ; also sheet 2,4,7,22,29
KEY_LAEXDP_: F11.T2(V2:IN3) ; also sheet 2
KEY_ST: E26.U2(V2:IN2B) ; also sheet 2,4,5,7
LOAD_SF_: C12.P2(P2:OUT) ; also sheet 21
MANUAL_PRESET_: E33.K1(L1:S) F20.E1(F1:IN2) ; also sheet 2,4,21,29
MB03_: F19.T2(V2:IN3) ; also sheet 4,5,6,7,9,14,15,16,18,22,23,30,32,33,35,36,37
MB04_: F19.U2(V2:IN4) ; also sheet 5,9,14,15,16,18,23,27,29,30,32,33,34,35,36,37
MB05_: F23.R2(V2:IN1) ; also sheet 5,9,14,15,16,18,22,23,29,30,33,35,36,38
MB06_: F23.S2(V2:IN2) ; also sheet 5,9,14,15,18,22,23,29,30,32,34,35,36,37,38
MB07_: F23.T2(V2:IN3) ; also sheet 5,9,14,16,18,22,23,26,28,29,30,32,33,34,36
MB08_: F23.U2(V2:IN4) ; also sheet 6,7,9,14,16,18,22,23,26,28,29,30,32,33,34,35
MB10: E14.H1(J1:IN3) ; also sheet 2,6,9,14,21,22,27,29,30,33,37
MB10_: F21.L2(N2:IN1) ; also sheet 6,9,18,22,23,26,27,28,30,37
MB11_: E33.P1(S1:D) F21.M2(N2:IN2) ; also sheet 2,5,7,9,18,22,23,26,28,29,30
MEM_DONE_: E33.F2(H2:S) ; also sheet 2,17,21,29
MEMORY_INCREMENT: E11.U2(V2:IN2) ; also sheet 6,14
MFTP2: E26.V1(V2:IN2A) ; also sheet 2,4,7
N$23: E33.J1(L1:D) F11.V2(V2:OUT)
N$114: F20.B1(C1:IN2) F20.F1(F1:OUT)
N$116: E33.D1(E1:S) F20.C1(C1:OUT)
N$117: E11.V2(V2:OUT) E12.R2(S2:IN2)
N$118: E12.S2(S2:OUT) F21.A1(C1:IN1)
N$119: E33.E2(H2:D) F21.C1(C1:OUT)
N$121: F21.D2(F2:IN1) F21.K1(K1:OUT)
N$122: E33.L2(P2:C) F21.F2(F2:OUT)
N$123: E33.N1(S1:C) F21.K2(K2:OUT)
N$124: F19.H1(L1:IN2) F21.N2(N2:OUT)
N$125: E14.F1(J1:IN2) F19.J1(L1:IN3) F21.S1(S1:OUT) F21.T2(V2:IN1)
N$126: F19.V2(V2:OUT) F21.P1(S1:IN1)
N$127: F19.L1(L1:OUT) F21.H2(K2:IN1)
N$134: F21.R2(S2:IN2) F23.V2(V2:OUT)
N$135: E14.E1(J1:IN1) F19.K1(L1:IN4) F21.S2(S2:OUT) F21.U2(V2:IN2)
PROCESSOR_IOT_: F21.V2(V2:OUT) ; also sheet 2
STROBE_: F20.D1(F1:IN1) ; also sheet 2,17,21
TP1: E26.S1(V2:IN1A) ; also sheet 2,3,4,7
TP2: E33.D2(H2:C) ; also sheet 2,4,7
TP4: E33.B1(E1:C) ; also sheet 2,4,7,29
TS4: C12.L2(P2:IN2) ; also sheet 2,5
WC_OVERFLOW_: E33.H2 ; also sheet 14
WORD_COUNT_: E12.P2(S2:IN1) ; also sheet 4,21
Unconnected: E33.F1 E33.J2 E33.L1 E33.P2

### Notes on the sheet
- 8i-00002 or 8i-00020?
- 8i-00002 or 8i-00020?
- D-BS-8i-0-7 Interrupt and Break Control

## Sheet 9 of 40
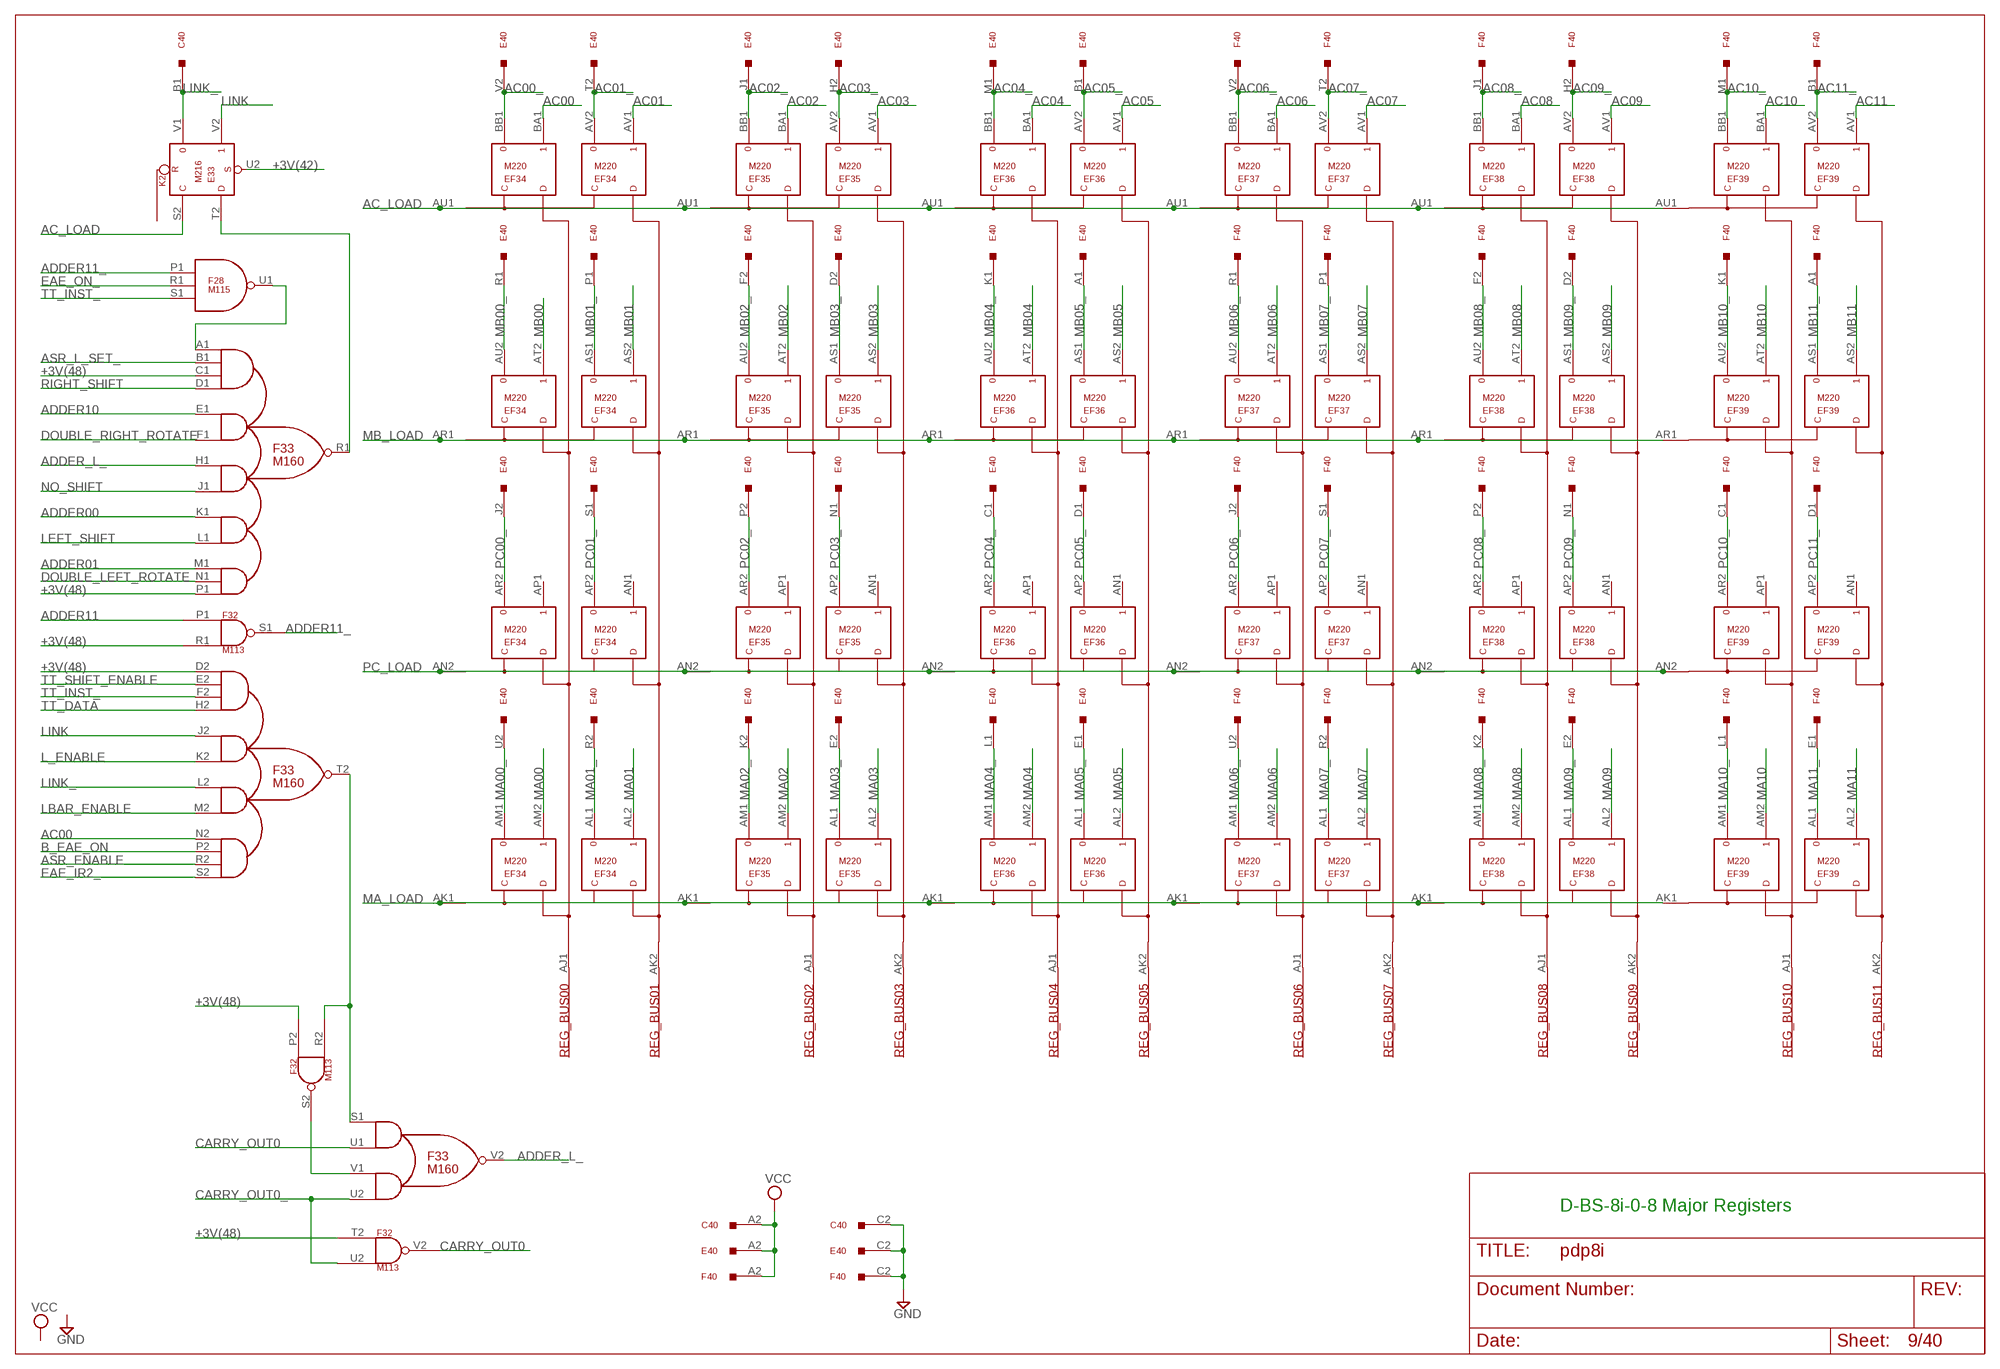
[diagram p8: schematic, sheet 9]

### Parts
C40  M900  M916  [H807]
E40  M900  M916  [H807]
EF34  M220  [H807-2]
EF35  M220  [H807-2]
EF36  M220  [H807-2]
EF37  M220  [H807-2]
EF38  M220  [H807-2]
EF39  M220  [H807-2]
F33  M160  [H807]
F40  M900  M916  [H807]

### Nets
+3V(42): E33.U2(V2:S) ; also sheet 1,5,8,17
+3V(48): F32.P2(S2:IN1) F32.R1(S1:IN2) F32.T2(V2:IN1) F33.C1(R1:IN1C) F33.D2(T2:IN1A) F33.P1(R1:IN5C) ; also sheet 1,6,7
AC00: EF34.BA1 F33.N2(T2:IN4A) ; also sheet 7,14,27,28,37
AC00_: E40.V2 EF34.BB1 ; also sheet 7,27
AC01: EF34.AV1 ; also sheet 14,27,28,37
AC01_: E40.T2 EF34.AV2 ; also sheet 7,27
AC02: EF35.BA1 ; also sheet 14,27,28,33,37
AC02_: E40.J1 EF35.BB1 ; also sheet 7,27
AC03: EF35.AV1 ; also sheet 14,28,33,37
AC03_: E40.H2 EF35.AV2 ; also sheet 7,27
AC04: EF36.BA1 ; also sheet 14,16,28,33,35,37
AC04_: E40.M1 EF36.BB1 ; also sheet 7
AC05: EF36.AV1 ; also sheet 14,16,28,33,35,37
AC05_: E40.B1 EF36.AV2 ; also sheet 7
AC06: EF37.BA1 ; also sheet 14,16,28,33,35,37
AC06_: EF37.BB1 F40.V2 ; also sheet 7
AC07: EF37.AV1 ; also sheet 14,16,28,33,35,37
AC07_: EF37.AV2 F40.T2 ; also sheet 7
AC08: EF38.BA1 ; also sheet 14,16,28,33,35,37
AC08_: EF38.BB1 F40.J1 ; also sheet 7
AC09: EF38.AV1 ; also sheet 14,16,28,33,35,37
AC09_: EF38.AV2 F40.H2 ; also sheet 7
AC10: EF39.BA1 ; also sheet 14,16,28,33,35,37
AC10_: EF39.BB1 F40.M1 ; also sheet 7
AC11: EF39.AV1 ; also sheet 14,16,28,33,35,37
AC11_: EF39.AV2 F40.B1 ; also sheet 7
AC_LOAD: E33.S2(V2:C) EF34.AU1 EF35.AU1 EF36.AU1 EF37.AU1 EF38.AU1 EF39.AU1 ; also sheet 7
ADDER00: F33.K1(R1:IN4A) ; also sheet 10,13
ADDER01: F33.M1(R1:IN5A) ; also sheet 10
ADDER10: F33.E1(R1:IN2A) ; also sheet 12,13
ADDER11: F32.P1(S1:IN1) ; also sheet 10,12,13
ADDER11_: F28.P1(U1:IN1) F32.S1(S1:OUT) ; also sheet 28
ADDER_L_: F33.H1(R1:IN3A) F33.V2(V2:OUT) ; also sheet 10,13,28
ASR_ENABLE: F33.R2(T2:IN4C) ; also sheet 27
ASR_L_SET_: F33.B1(R1:IN1B) ; also sheet 27
B_EAE_ON: F33.P2(T2:IN4B) ; also sheet 27,28
CARRY_OUT0: F32.V2(V2:OUT) F33.U1(V2:IN1B) ; also sheet 7,8
CARRY_OUT0_: F32.U2(V2:IN2) F33.U2(V2:IN2B) ; also sheet 10
DOUBLE_LEFT_ROTATE: F33.N1(R1:IN5B) ; also sheet 6,10,11,12,13
DOUBLE_RIGHT_ROTATE: F33.F1(R1:IN2B) ; also sheet 6,10,11,12,13
EAE_IR2_: F33.S2(T2:IN4D) ; also sheet 27
EAE_ON_: F28.R1(U1:IN2) ; also sheet 13,27
GND [Suppply]: C40.C2 E40.C2 F40.C2 ; also sheet 2,5,10,11,12,13,14,15,17,18,23,26,27,30,33,34,35,39
L_ENABLE: F33.K2(T2:IN2B) ; also sheet 5
LBAR_ENABLE: F33.M2(T2:IN3B) ; also sheet 5
LEFT_SHIFT: F33.L1(R1:IN4B) ; also sheet 6,10,11,12,13
LINK: E33.V2 F33.J2(T2:IN2A) ; also sheet 7
LINK_: C40.B1 E33.V1 F33.L2(T2:IN3A)
MA00: EF34.AM2 ; also sheet 19,24
MA00_: E40.U2 EF34.AM1 ; also sheet 6,19,21,24
MA01: EF34.AL2 ; also sheet 19,24
MA01_: E40.R2 EF34.AL1 ; also sheet 6,21
MA02: EF35.AM2 ; also sheet 19,24
MA02_: E40.K2 EF35.AM1 ; also sheet 6,21
MA03: EF35.AL2 ; also sheet 19,24
MA03_: E40.E2 EF35.AL1 ; also sheet 6,19,21,24
MA04: EF36.AM2 ; also sheet 19,24
MA04_: E40.L1 EF36.AM1 ; also sheet 6,21
MA05: EF36.AL2 ; also sheet 19,24
MA05_: E40.E1 EF36.AL1 ; also sheet 6,21
MA06: EF37.AM2 ; also sheet 20,25
MA06_: EF37.AM1 F40.U2 ; also sheet 6,20,21,25
MA07: EF37.AL2 ; also sheet 20,25
MA07_: EF37.AL1 F40.R2 ; also sheet 6,21
MA08: EF38.AM2 ; also sheet 6,20,25
MA08_: EF38.AM1 F40.K2 ; also sheet 21
MA09: EF38.AL2 ; also sheet 20,25
MA09_: EF38.AL1 F40.E2 ; also sheet 20,21,25
MA10: EF39.AM2 ; also sheet 20,25
MA10_: EF39.AM1 F40.L1 ; also sheet 21
MA11: EF39.AL2 ; also sheet 20,25
MA11_: EF39.AL1 F40.E1 ; also sheet 21
MA_LOAD: EF34.AK1 EF35.AK1 EF36.AK1 EF37.AK1 EF38.AK1 EF39.AK1 ; also sheet 7
MB00: EF34.AT2 ; also sheet 14,21,30
MB00_: E40.R1 EF34.AU2 ; also sheet 18,23,30
MB01: EF34.AS2 ; also sheet 14,21,30
MB01_: E40.P1 EF34.AS1 ; also sheet 18,23,30
MB02: EF35.AT2 ; also sheet 14,21,30
MB02_: E40.F2 EF35.AU2 ; also sheet 18,23,30
MB03: EF35.AS2 ; also sheet 4,5,14,21,27,29,30,34,38
MB03_: E40.D2 EF35.AS1 ; also sheet 4,5,6,7,8,14,15,16,18,22,23,30,32,33,35,36,37
MB04: EF36.AT2 ; also sheet 5,14,21,22,30,38
MB04_: E40.K1 EF36.AU2 ; also sheet 5,8,14,15,16,18,23,27,29,30,32,33,34,35,36,37
MB05: EF36.AS2 ; also sheet 5,7,14,21,27,30,32,34,37
MB05_: E40.A1 EF36.AS1 ; also sheet 5,8,14,15,16,18,22,23,29,30,33,35,36,38
MB06: EF37.AT2 ; also sheet 5,7,14,16,21,22,27,30,33,38
MB06_: EF37.AU2 F40.R1 ; also sheet 5,8,14,15,18,22,23,29,30,32,34,35,36,37,38
MB07: EF37.AS2 ; also sheet 5,7,14,15,21,22,26,27,30,33,34,35,37,38
MB07_: EF37.AS1 F40.P1 ; also sheet 5,8,14,16,18,22,23,26,28,29,30,32,33,34,36
MB08: EF38.AT2 ; also sheet 6,7,14,15,21,22,26,27,30,33,34,36,37,38
MB08_: EF38.AU2 F40.F2 ; also sheet 6,7,8,14,16,18,22,23,26,28,29,30,32,33,34,35
MB09: EF38.AS2 ; also sheet 2,5,6,14,21,22,27,29,30,37
MB09_: EF38.AS1 F40.D2 ; also sheet 6,18,23,26,27,28,30,33,37
MB10: EF39.AT2 ; also sheet 2,6,8,14,21,22,27,29,30,33,37
MB10_: EF39.AU2 F40.K1 ; also sheet 6,8,18,22,23,26,27,28,30,37
MB11: EF39.AS2 ; also sheet 2,6,14,21,22,27,29,30,33,37
MB11_: EF39.AS1 F40.A1 ; also sheet 2,5,7,8,18,22,23,26,28,29,30
MB_LOAD: EF34.AR1 EF35.AR1 EF36.AR1 EF37.AR1 EF38.AR1 EF39.AR1 ; also sheet 7
N$128: E33.T2(V2:D) F33.R1(R1:OUT)
N$129: F32.S2(S2:OUT) F33.V1(V2:IN2A)
N$130: F28.U1(U1:OUT) F33.A1(R1:IN1A)
N$137: F32.R2(S2:IN2) F33.S1(V2:IN1A) F33.T2(T2:OUT)
NO_SHIFT: F33.J1(R1:IN3B) ; also sheet 6,10,11,12,13
PC00_: E40.J2 EF34.AR2
PC01_: E40.S1 EF34.AP2
PC02_: E40.P2 EF35.AR2
PC03_: E40.N1 EF35.AP2
PC04_: E40.C1 EF36.AR2
PC05_: E40.D1 EF36.AP2
PC06_: EF37.AR2 F40.J2
PC07_: EF37.AP2 F40.S1
PC08_: EF38.AR2 F40.P2
PC09_: EF38.AP2 F40.N1
PC10_: EF39.AR2 F40.C1
PC11_: EF39.AP2 F40.D1
PC_LOAD: EF34.AN2 EF35.AN2 EF36.AN2 EF37.AN2 EF38.AN2 EF39.AN2 ; also sheet 7,22
RIGHT_SHIFT: F33.D1(R1:IN1D) ; also sheet 6,10,11,12,13,28
TT_DATA: F33.H2(T2:IN1D) ; also sheet 29
TT_INST_: F28.S1(U1:IN3) F33.F2(T2:IN1C) ; also sheet 2,14,29
TT_SHIFT_ENABLE: F33.E2(T2:IN1B) ; also sheet 29
VCC [Suppply]: C40.A2 E40.A2 F40.A2 ; also sheet 12,33
Unconnected: C40.A1 C40.B2 C40.D2 C40.E1 C40.E2 C40.F2 C40.H1 C40.H2 C40.J1 C40.K1 C40.K2 C40.L1 C40.M1 C40.P1 C40.R1 C40.R2 C40.T1 C40.T2 C40.U1 C40.U2 C40.V1 C40.V2 E40.B2 E40.T1 E40.U1 E40.V1 EF34.AJ1 EF34.AK2 EF34.AN1 EF34.AP1 EF35.AJ1 EF35.AK2 EF35.AN1 EF35.AP1 EF36.AJ1 EF36.AK2 EF36.AN1 EF36.AP1 EF37.AJ1 EF37.AK2 EF37.AN1 EF37.AP1 EF38.AJ1 EF38.AK2 EF38.AN1 EF38.AP1 EF39.AJ1 EF39.AK2 EF39.AN1 EF39.AP1 F40.B2 F40.T1 F40.U1 F40.V1

### Notes on the sheet
- REG_BUS00 | REG_BUS01 | REG_BUS02 | REG_BUS03 | REG_BUS04 | REG_BUS05 | REG_BUS06 | REG_BUS07 | REG_BUS08 | REG_BUS09 | REG_BUS10 | REG_BUS11
- D-BS-8i-0-8 Major Registers